# Altium project audio_dev_pcb.PrjPcb (part 2 of 3)

## Sheet USB_HS.SchDoc
size A3; SheetNumber: 5; SheetTotal: 13
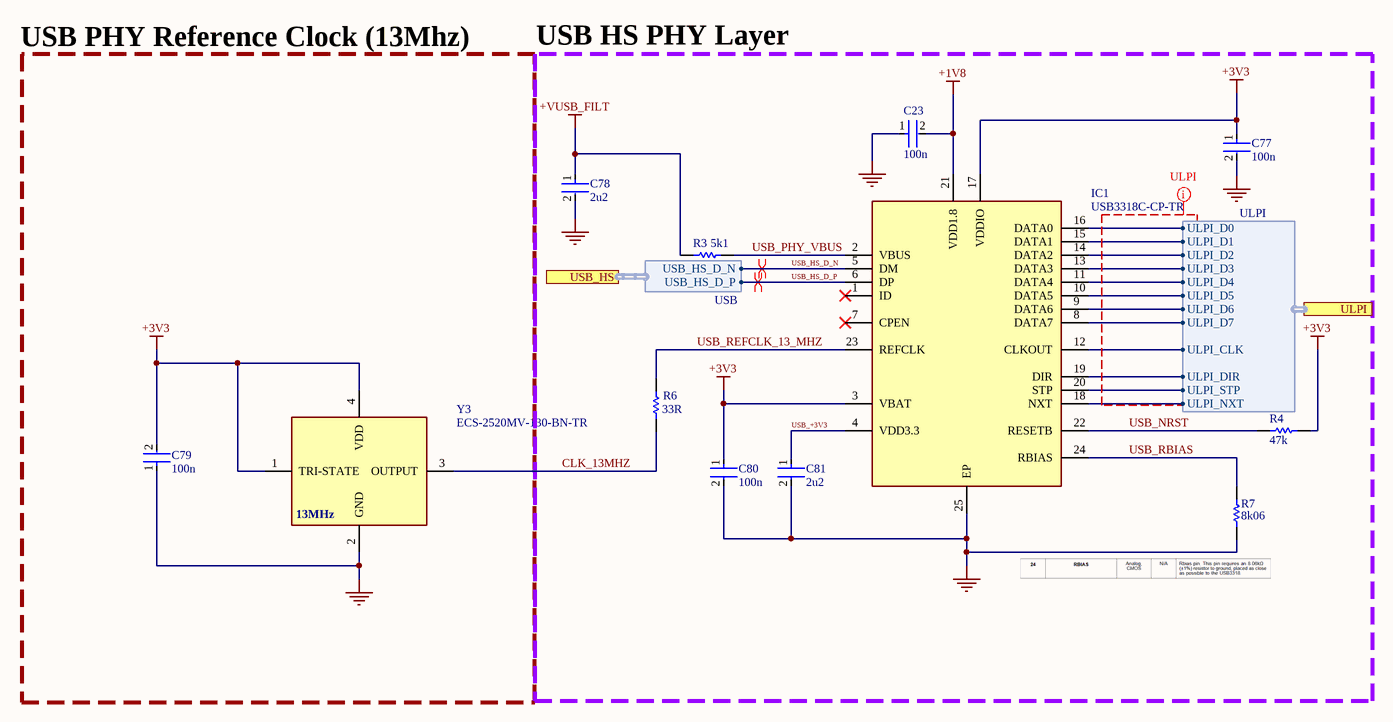
[diagram p6: USB_HS.SchDoc]

### Parts
C23  Capacitance: 100n  [FP-GCM155-0_05-IPC_A]  (hidden comment: GCM155R71H104ME02J)
C77  Capacitance: 100n  [FP-GCM155-0_05-IPC_A]  (hidden comment: GCM155R71H104ME02J)
C78  Capacitance: 2u2  [FP-GCH188-0_1-e0_2_0_5-MFG]  (hidden comment: GCM188C71A225KE02D)
C79  Capacitance: 100n  [FP-GCM155-0_05-IPC_A]  (hidden comment: GCM155R71H104ME02J)
C80  Capacitance: 100n  [FP-GCM155-0_05-IPC_A]  (hidden comment: GCM155R71H104ME02J)
C81  Capacitance: 2u2  [FP-GCH188-0_1-e0_2_0_5-MFG]  (hidden comment: GCM188C71A225KE02D)
IC1  USB3318C-CP-TR  [QFN50P400X400X100-25N-D]
R3  Resistance: 5k1  [RESC1005X40X25ML05T10]  (hidden comment: RC0402JR-075K1L)
R4  Resistance: 47k  [RESC1005X40X25LL05T10]  (hidden comment: RC0402JR-0747KL)
R6  Resistance: 33R  [RESC1005X40X25ML05T10]  (hidden comment: RC0402JR-1333RL)
R7  Resistance: 8k06  [RESC1005X40X25NL05T10]  (hidden comment: RC0402FR-07806KL)
Y3  ECS-2520MV-130-BN-TR  [ECS2520MV130BNTR]

### Blocks framed on the sheet
USB PHY Reference Clock (13Mhz): C79 Y3
USB HS PHY Layer: C23 C77 C78 C80 C81 IC1 R3 R4 R6 R7

### Ports
ULPI (harness ULPI, see high_level[5B], MCU_Connections[1B]), USB_HS (harness USB, see high_level[5B], Peripherals[4A])

### Harnesses
USB: USB_HS_D_N, USB_HS_D_P
ULPI: ULPI_D0, ULPI_D1, ULPI_D2, ULPI_D3, ULPI_D4, ULPI_D5, ULPI_D6, ULPI_D7, ULPI_CLK, ULPI_DIR, ULPI_STP, ULPI_NXT

### Nets
+1V8: C23.2 IC1.21(VDD1.8)
+3V3: C77.1 C79.2 C80.1 IC1.3(VBAT) IC1.17(VDDIO) R4.2 Y3.1(TRI-STATE) Y3.4(VDD)
+VUSB_FILT: C78.1 R3.1
GND: C23.1 C77.2 C78.2 C79.1 C80.2 C81.2 IC1.25(EP) R7.1 Y3.2(GND)
CLK_13MHZ: R6.2 Y3.3(OUTPUT)
USB_+3V3: C81.1 IC1.4(VDD3.3)
USB_HS_D_N: IC1.5(DM) ; port USB_HS.USB_HS_D_N
USB_HS_D_P: IC1.6(DP) ; port USB_HS.USB_HS_D_P
USB_NRST: IC1.22(RESETB) R4.1
USB_PHY_VBUS: IC1.2(VBUS) R3.2
USB_RBIAS: IC1.24(RBIAS) R7.2
USB_REFCLK_13_MHZ: IC1.23(REFCLK) R6.1
NetIC1_8: IC1.8(DATA7) ; port ULPI.ULPI_D7
NetIC1_9: IC1.9(DATA6) ; port ULPI.ULPI_D6
NetIC1_10: IC1.10(DATA5) ; port ULPI.ULPI_D5
NetIC1_11: IC1.11(DATA4) ; port ULPI.ULPI_D4
NetIC1_12: IC1.12(CLKOUT) ; port ULPI.ULPI_CLK
NetIC1_13: IC1.13(DATA3) ; port ULPI.ULPI_D3
NetIC1_14: IC1.14(DATA2) ; port ULPI.ULPI_D2
NetIC1_15: IC1.15(DATA1) ; port ULPI.ULPI_D1
NetIC1_16: IC1.16(DATA0) ; port ULPI.ULPI_D0
NetIC1_18: IC1.18(NXT) ; port ULPI.ULPI_NXT
NetIC1_19: IC1.19(DIR) ; port ULPI.ULPI_DIR
NetIC1_20: IC1.20(STP) ; port ULPI.ULPI_STP

Not connected (* = marked no-connect by the designer): IC1 1(ID)* 7(CPEN)*

### Layout directives
mark named ULPI: (no net found under the mark)
differential pair: USB_HS_D_N, USB_HS_D_P

### Notes on the sheet
- (near Y3) 13MHz

### Library data of the parts
C23 C77 C79 C80 = CMP-06035-028957-1: as C95 on sheet Memory
C78 C81 = CMP-00260-57357036-1: as C94 on sheet Memory; NexarPartId: 57357036; RoHS: Non-Compliant; Lifecycle Status: Production
IC1 = USB3318C-CP-TR: Integrated Circuit; Manufacturer_Name: Microchip; Datasheet Link: http://www.microchip.com/mymicrochip/filehandler.aspx?ddocname=en562029; Height: 1mm; Manufacturer_Part_Number: USB3318C-CP-TR; Mouser Part Number: 886-USB3318C-CP-TR; Mouser Price/Stock: https://www.mouser.co.uk/ProductDetail/Microchip-Technology/USB3318C-CP-TR?qs=pA5MXup5wxEqKRd0j%252Bo%252BXA%3D%3D; Arrow Part Number: USB3318C-CP-TR; Arrow Price/Stock: null?region=nac
R3 = CMP-2002-08025-1: Manufacturer: Yageo / Phycomp; Part Number: RC0402JR-075K1L
R4 = CMP-1011-00114-2: Manufacturer: Yageo / Phycomp; Part Number: RC0402JR-0747KL
R6 = CMP-2002-08082-1: Manufacturer: Yageo; Part Number: RC0402JR-1333RL
R7 = CMP-1011-00838-2: Manufacturer: Yageo / Phycomp; Part Number: RC0402FR-07806KL
Y3 = ECS-2520MV-130-BN-TR: Crystal or Oscillator; Manufacturer_Name: ECS; Datasheet Link: https://ecsxtal.com/store/pdf/ECS-2520MV.pdf; Height: 0.9mm; Manufacturer_Part_Number: ECS-2520MV-130-BN-TR; Mouser Part Number: 520-S2520MV130BNTR; Mouser Price/Stock: https://www.mouser.co.uk/ProductDetail/ECS/ECS-2520MV-130-BN-TR?qs=zW32dvEIR3txl7djIFQDkw%3D%3D; Arrow Part Number: ECS-2520MV-130-BN-TR; Arrow Price/Stock: https://www.arrow.com/en/products/ecs-2520mv-130-bn-tr/ecs-international?utm_currency=USD&region=nac

## Sheet Peripherals.SchDoc
size A3; SheetNumber: 7; SheetTotal: 13
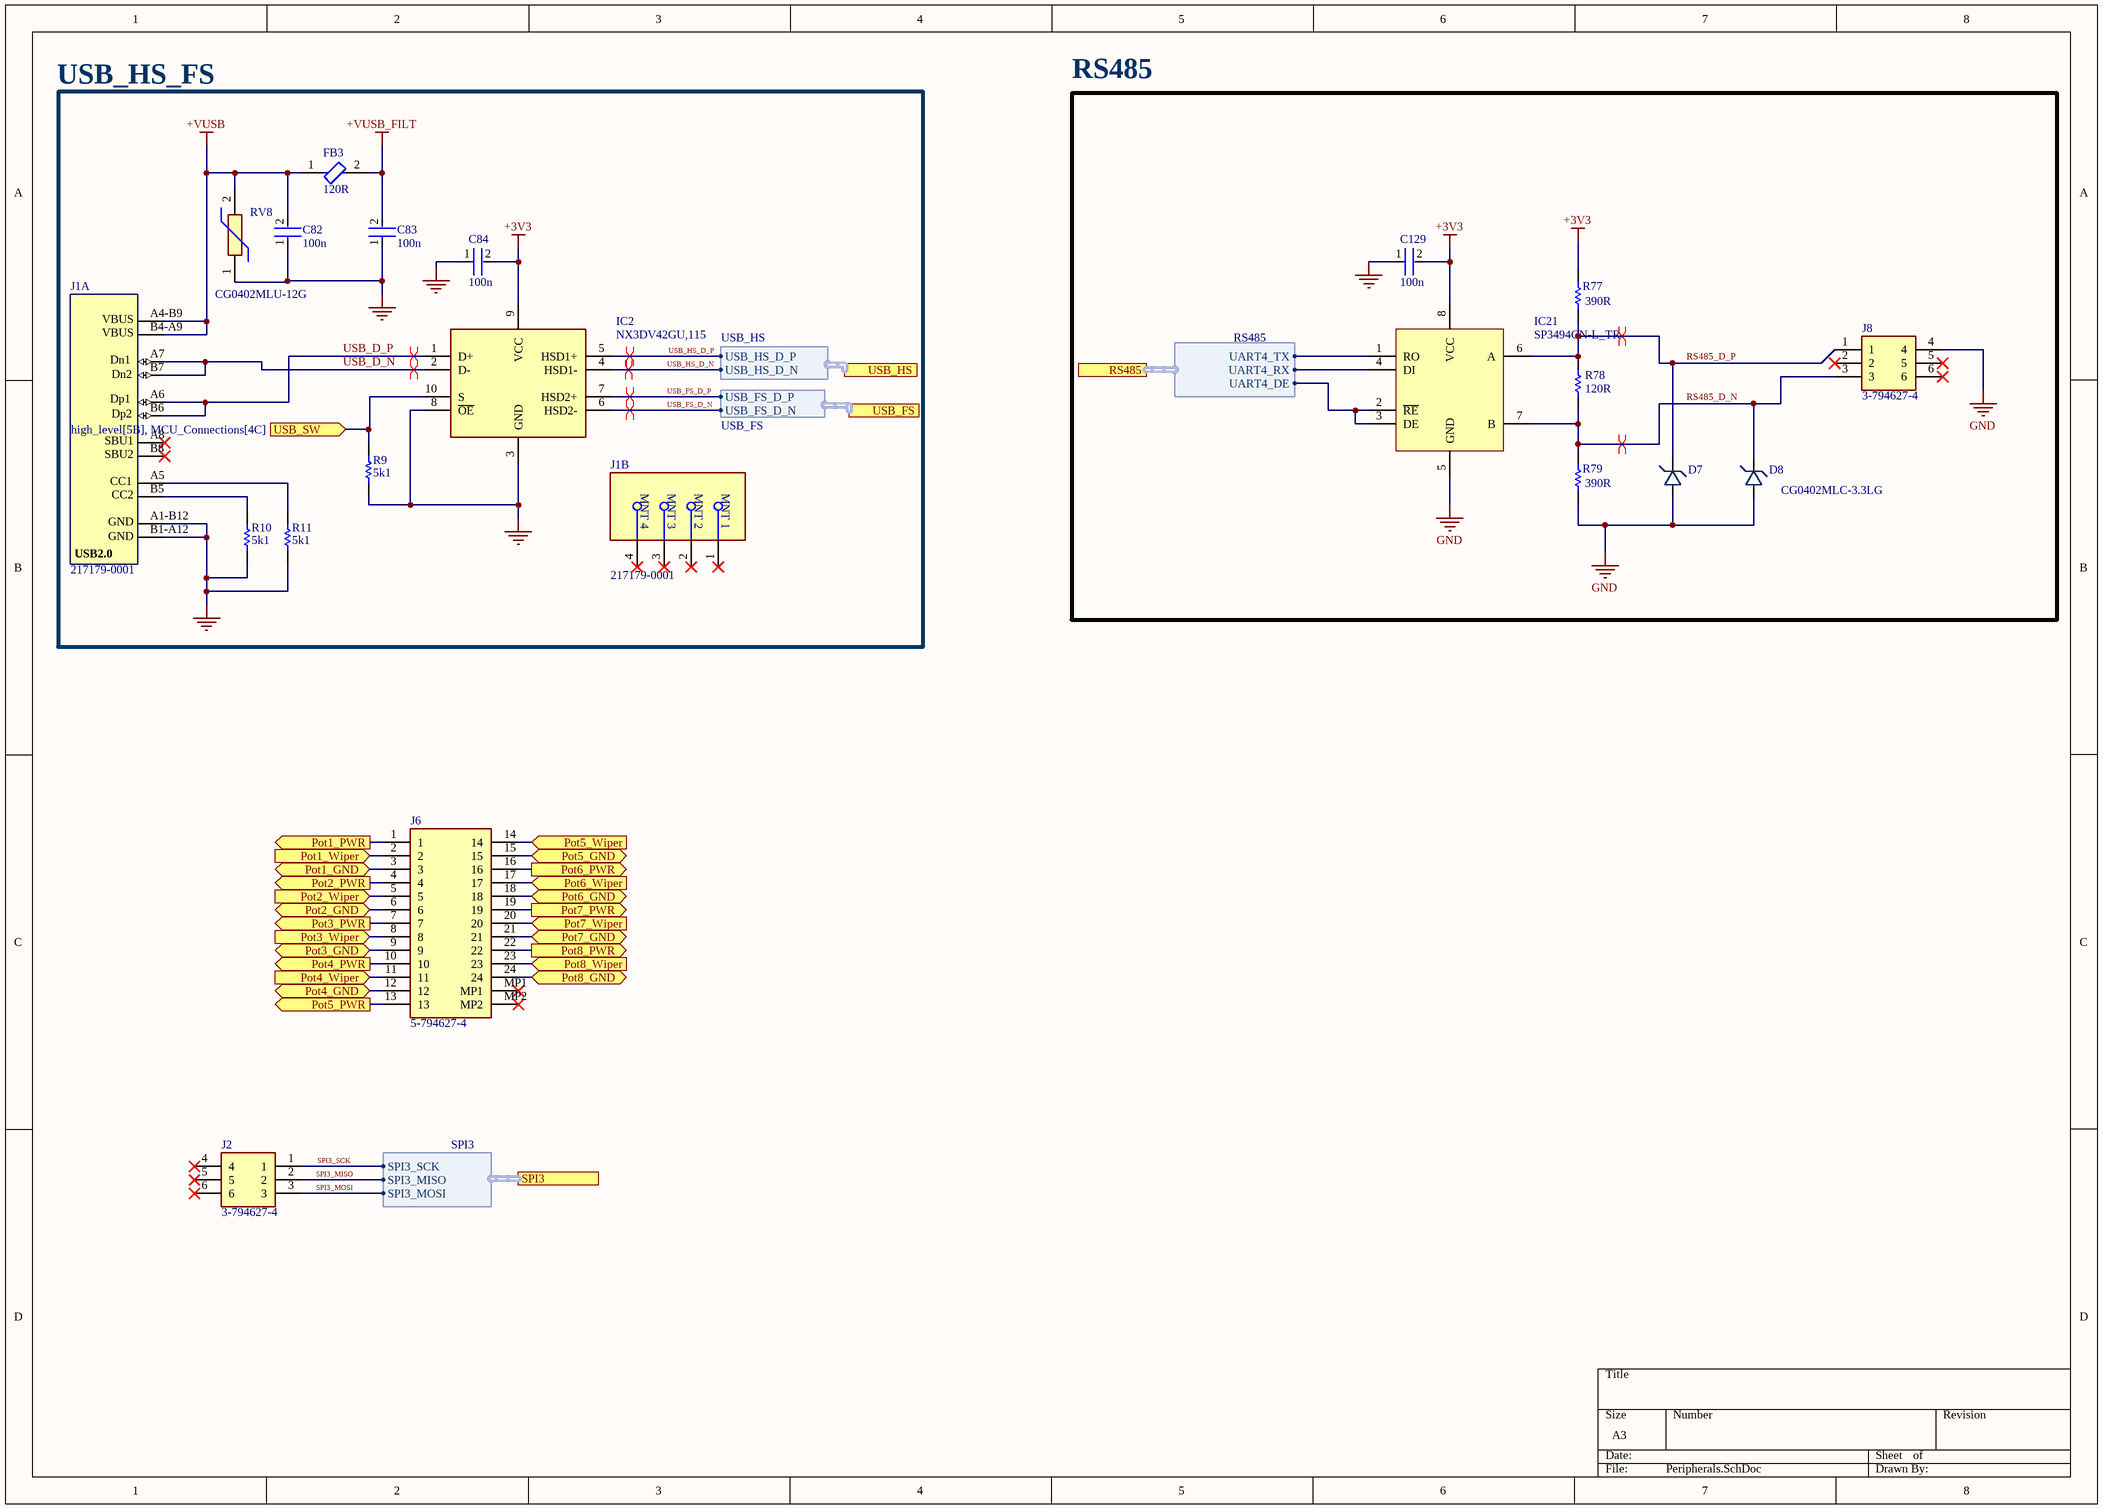
[diagram p7: Peripherals.SchDoc]

### Parts
C82  Capacitance: 100n  [FP-GCM155-0_05-IPC_A]  (hidden comment: GCM155R71H104ME02J)
C83  Capacitance: 100n  [FP-GCM155-0_05-IPC_A]  (hidden comment: GCM155R71H104ME02J)
C84  Capacitance: 100n  [FP-GCM155-0_05-IPC_A]  (hidden comment: GCM155R71H104ME02J)
C129  Capacitance: 100n  [FP-GCM155-0_05-IPC_A]  (hidden comment: GCM155R71H104ME02J)
D7  CG0402MLC-3.3LG  [CG0402MLC-3.3LG]  (value not drawn)
D8  CG0402MLC-3.3LG  [CG0402MLC-3.3LG]
FB3  Impedance: 120R  [FP-MPZ1005-MFG]  (hidden comment: MPZ1005S121ET000)
IC2  NX3DV42GU,115  [QFN40P140X180X50-10N]
IC21  SP3494CN-L_TR  [SOIC127P600X175-8N]
J1  217179-0001  [FP-2171790001-MFG]  (parts A,B of 2)
J2  3-794627-4  [37946274]
J6  5-794627-4  [57946274]
J8  3-794627-4  [37946274]
R9  Resistance: 5k1  [RESC1005X40X25ML05T10]  (hidden comment: RC0402JR-075K1L)
R10  Resistance: 5k1  [RESC1005X40X25ML05T10]  (hidden comment: RC0402JR-075K1L)
R11  Resistance: 5k1  [RESC1005X40X25ML05T10]  (hidden comment: RC0402JR-075K1L)
R77  Resistance: 390R  [RESC1005X40X25ML05T10]  (hidden comment: RC0402JR-07390RL)
R78  Resistance: 120R  [RESC1005X40X25NL05T10]  (hidden comment: RC0402FR-07120RL)
R79  Resistance: 390R  [RESC1005X40X25ML05T10]  (hidden comment: RC0402JR-07390RL)
RV8  CG0402MLU-12G  [VARC1005X41N]

### Blocks framed on the sheet
USB_HS_FS: C82-C84 FB3 IC2 J1 R9-R11 RV8
RS485: C129 D7 D8 IC21 J8 R77-R79

### Ports
Pot1_GND (bidir, see high_level[5C], Potentiometers[1B]), Pot1_PWR (out, see high_level[5C], Potentiometers[1A]), Pot1_Wiper (in, see high_level[5C], Potentiometers[1A]), Pot2_GND (bidir, see high_level[5C], Potentiometers[1B]), Pot2_PWR (out, see high_level[5C], Potentiometers[1B]), Pot2_Wiper (in, see high_level[5C], Potentiometers[1B]), Pot3_GND (bidir, see high_level[5C], Potentiometers[1C]), Pot3_PWR (out, see high_level[5C], Potentiometers[1C]), Pot3_Wiper (in, see high_level[5C], Potentiometers[1C]), Pot4_GND (bidir, see high_level[5C], Potentiometers[5B]), Pot4_PWR (out, see high_level[5C], Potentiometers[5A]), Pot4_Wiper (in, see high_level[5C], Potentiometers[5A]), Pot5_GND (bidir, see high_level[5C], Potentiometers[5B]), Pot5_PWR (out, see high_level[5C], Potentiometers[5B]), Pot5_Wiper (in, see high_level[5C], Potentiometers[5B]), Pot6_GND (bidir, see high_level[5C], Potentiometers[5C]), Pot6_PWR (out, see high_level[5C], Potentiometers[5C]), Pot6_Wiper (in, see high_level[5C], Potentiometers[5C]), Pot7_GND (bidir, see high_level[5C], Potentiometers[1D]), Pot7_PWR (out, see high_level[5C], Potentiometers[1D]), Pot7_Wiper (in, see high_level[5C], Potentiometers[1D]), Pot8_GND (bidir, see high_level[5C], Potentiometers[5D]), Pot8_PWR (out, see high_level[5C], Potentiometers[5D]), Pot8_Wiper (in, see high_level[5C], Potentiometers[5D]), RS485 (harness RS485, see high_level[5B], MCU_Connections[4C]), SPI3 (harness SPI3, see high_level[5B], MCU_Connections[5C]), USB_FS (harness USB_FS, see high_level[5B], MCU_Connections[4C]), USB_HS (harness USB_HS, see high_level[5B], USB_HS[4B]), USB_SW (in, see high_level[5B], MCU_Connections[4C])

### Harnesses
USB_HS: USB_HS_D_P, USB_HS_D_N
USB_FS: USB_FS_D_P, USB_FS_D_N
SPI3: SPI3_SCK, SPI3_MISO, SPI3_MOSI
RS485: UART4_TX, UART4_RX, UART4_DE

### Nets
+3V3: C84.2 C129.2 IC2.9(VCC) IC21.8(VCC) J6.1 J6.4 J6.7 J6.10 J6.13 J6.16 J6.19 J6.22 R77.2 ; port Pot5_PWR, port Pot4_PWR, port Pot8_PWR, port Pot6_PWR, port Pot2_PWR, port Pot7_PWR, port Pot3_PWR, port Pot1_PWR
+VUSB: C82.2 FB3.1 J1.A4-B9(VBUS) J1.B4-A9(VBUS) RV8.2
+VUSB_FILT: C83.2 FB3.2
GND: C82.1 C83.1 C84.1 C129.1 D7.2 D8.2 IC2.3(GND) IC2.8(~{OE}) IC21.5(GND) J1.A1-B12(GND) J1.B1-A12(GND) J6.3 J6.6 J6.9 J6.12 J6.15 J6.18 J6.21 J6.24 J8.4 R9.1 R10.1 R11.1 R79.1 RV8.1 ; port Pot5_GND, port Pot4_GND, port Pot8_GND, port Pot6_GND, port Pot2_GND, port Pot1_GND, port Pot7_GND, port Pot3_GND
Pot1_Wiper: J6.2 ; port Pot1_Wiper
Pot2_Wiper: J6.5 ; port Pot2_Wiper
Pot3_Wiper: J6.8 ; port Pot3_Wiper
Pot4_Wiper: J6.11 ; port Pot4_Wiper
Pot5_Wiper: J6.14 ; port Pot5_Wiper
Pot6_Wiper: J6.17 ; port Pot6_Wiper
Pot7_Wiper: J6.20 ; port Pot7_Wiper
Pot8_Wiper: J6.23 ; port Pot8_Wiper
RS485_D_N: D8.1 IC21.7(B) J8.3 R78.1 R79.2
RS485_D_P: D7.1 IC21.6(A) J8.1 R77.1 R78.2
SPI3_MISO: J2.2 ; port SPI3.SPI3_MISO
SPI3_MOSI: J2.3 ; port SPI3.SPI3_MOSI
SPI3_SCK: J2.1 ; port SPI3.SPI3_SCK
USB_D_N: IC2.2(D-) J1.A7(Dn1) J1.B7(Dn2)
USB_D_P: IC2.1(D+) J1.A6(Dp1) J1.B6(Dp2)
USB_FS_D_N: IC2.6(HSD2-) ; port USB_FS.USB_FS_D_N
USB_FS_D_P: IC2.7(HSD2+) ; port USB_FS.USB_FS_D_P
USB_HS_D_N: IC2.4(HSD1-) ; port USB_HS.USB_HS_D_N
USB_HS_D_P: IC2.5(HSD1+) ; port USB_HS.USB_HS_D_P
USB_SW: IC2.10(S) R9.2 ; port USB_SW
NetIC21_1: IC21.1(RO) ; port RS485.UART4_TX
NetIC21_2: IC21.2(~{RE}) IC21.3(DE) ; port RS485.UART4_DE
NetIC21_4: IC21.4(DI) ; port RS485.UART4_RX
NetJ1_A5: J1.A5(CC1) R11.2
NetJ1_B5: J1.B5(CC2) R10.2

Not connected (* = marked no-connect by the designer): J1 1(MNT_1)* 2(MNT_2)* 3(MNT_3)* 4(MNT_4)* A8(SBU1)* B8(SBU2)*; J2 4* 5* 6*; J6 MP1* MP2*; J8 2* 5* 6*

### Layout directives
differential pair: (no net found under the mark), RS485_D_N, RS485_D_P, USB_D_N, USB_D_P, USB_FS_D_N, USB_FS_D_P, USB_HS_D_P

### Notes on the sheet
- (in symbol CMP-04767-000028-2, part A) USB2.0

### Library data of the parts
C82-C84 C129 = CMP-06035-028957-1: as C95 on sheet Memory
FB3 = CMP-08257-000274-1: Power line Ferrite Bead 120Ω @ 100MHz 1.5A DCR 0.095Ω SMD 0402; Tolerance: 25%; Number of Lines: 1; DC Resistance (DCR): 95mR; RoHS Compliant: Yes; Test Frequency: 100MHz; Length: 0.039inch; Case Code (Metric): 1005; Case/Package: 0402; Max Operating Temperature: 125°C; Max Current Rating: 1.5A; Termination: SMD/SMT; Case Code (Imperial): 0402; Width: 0.02inch; Weight: 2.3E-05oz; Max DC Current: 1.5A; Height: 0.022inch; Package Quantity: 10000; Mount: Surface Mount; Min Operating Temperature: -55°C; Packaging: Tape and Reel
IC2 = NX3DV42GU,115: Integrated Circuit; Manufacturer_Name: NXP; Datasheet Link: http://www.nxp.com/docs/en/data-sheet/NX3DV42.pdf; Height: 0.5mm; Manufacturer_Part_Number: NX3DV42GU,115; Mouser Part Number: 771-NX3DV42GU115; Mouser Price/Stock: https://www.mouser.co.uk/ProductDetail/NXP-Semiconductors/NX3DV42GU115?qs=cbprxTG2Yq%252BinzuyAklGVQ%3D%3D; Arrow Part Number: NX3DV42GU,115; Arrow Price/Stock: https://www.arrow.com/en/products/nx3dv42gu115/nxp-semiconductors?region=nac
IC21 = SP3494CN-L_TR: Integrated Circuit; Manufacturer_Name: MaxLinear; Manufacturer_Part_Number: SP3494CN-L/TR; Datasheet Link: https://www.arrow.com/en/products/sp3494cn-ltr/maxlinear-inc?region=nac; Height: 1.75mm; Mouser Part Number: 701-SP3494CN-L/TR; Mouser Price/Stock: https://www.mouser.co.uk/ProductDetail/MaxLinear/SP3494CN-L-TR?qs=3EMgrMjM0faUFCPV%252BPTaUQ%3D%3D; Arrow Part Number: SP3494CN-L/TR; Arrow Price/Stock: https://www.arrow.com/en/products/sp3494cn-ltr/maxlinear-inc?region=nac
J1 = CMP-04767-000028-2: CONN RCP USB2.0 TYP C 24P SMD RA; NexarPartId: 117190526; Gender: Receptacle; Number of Contacts: 16; Current Rating: 1.25A; Voltage Rating: 30V; Min Operating Temperature: -40°C; USB Standard: USB 2.0; Height: 3.36mm; Contact Material: Gold, Nickel; Max Operating Temperature: 85°C
J2 J8 = 3-794627-4: Connector; Manufacturer_Name: TE Connectivity; Datasheet Link: https://www.te.com/commerce/DocumentDelivery/DDEController?Action=srchrtrv&DocNm=micro-mate-n-lok-connector-qrg&DocType=Data%20Sheet&DocLang=English&PartCntxt=3-794627-4&DocFormat=pdf; Height: 8.8mm; Manufacturer_Part_Number: 3-794627-4; Mouser Part Number: 571-3-794627-4; Mouser Price/Stock: https://www.mouser.co.uk/ProductDetail/TE-Connectivity-AMP/3-794627-4?qs=FGSkXkE%2FZ3Wegb353BDzUA%3D%3D; Arrow Part Number: 3-794627-4; Arrow Price/Stock: https://www.arrow.com/en/products/3-794627-4/te-connectivity?utm_currency=USD&region=europe
J6 = 5-794627-4: Connector; Manufacturer_Name: TE Connectivity; Datasheet Link: https://www.te.com/commerce/DocumentDelivery/DDEController?Action=srchrtrv&DocNm=micro-mate-n-lok-connector-qrg&DocType=Data%20Sheet&DocLang=English&PartCntxt=5-794627-4&DocFormat=pdf; Height: 8.8mm; Manufacturer_Part_Number: 5-794627-4
R9-R11 = CMP-2002-08025-1: Manufacturer: Yageo / Phycomp; Part Number: RC0402JR-075K1L
R77 R79 = CMP-2002-07992-1: Manufacturer: Yageo / Phycomp; Part Number: RC0402JR-07390RL
R78 = CMP-2002-07370-1: Manufacturer: Yageo / Phycomp; Part Number: RC0402FR-07120RL
RV8 = CG0402MLU-12G: Varistor; Manufacturer_Name: Bourns; Datasheet Link: https://bourns.com/docs/product-datasheets/mlu.pdf?sfvrsn=1940d498_27; Height: 0.41mm; Manufacturer_Part_Number: CG0402MLU-12G; Mouser Part Number: 652-CG0402MLU-12G; Mouser Price/Stock: https://www.mouser.co.uk/ProductDetail/Bourns/CG0402MLU-12G?qs=m8myXnDJXpUNz33UIHxVhA%3D%3D; Arrow Part Number: CG0402MLU-12G; Arrow Price/Stock: https://www.arrow.com/en/products/cg0402mlu-12g/bourns?utm_currency=USD&region=nac

## Sheet Potentiometers.SchDoc
size A2; SheetNumber: 10; SheetTotal: 13
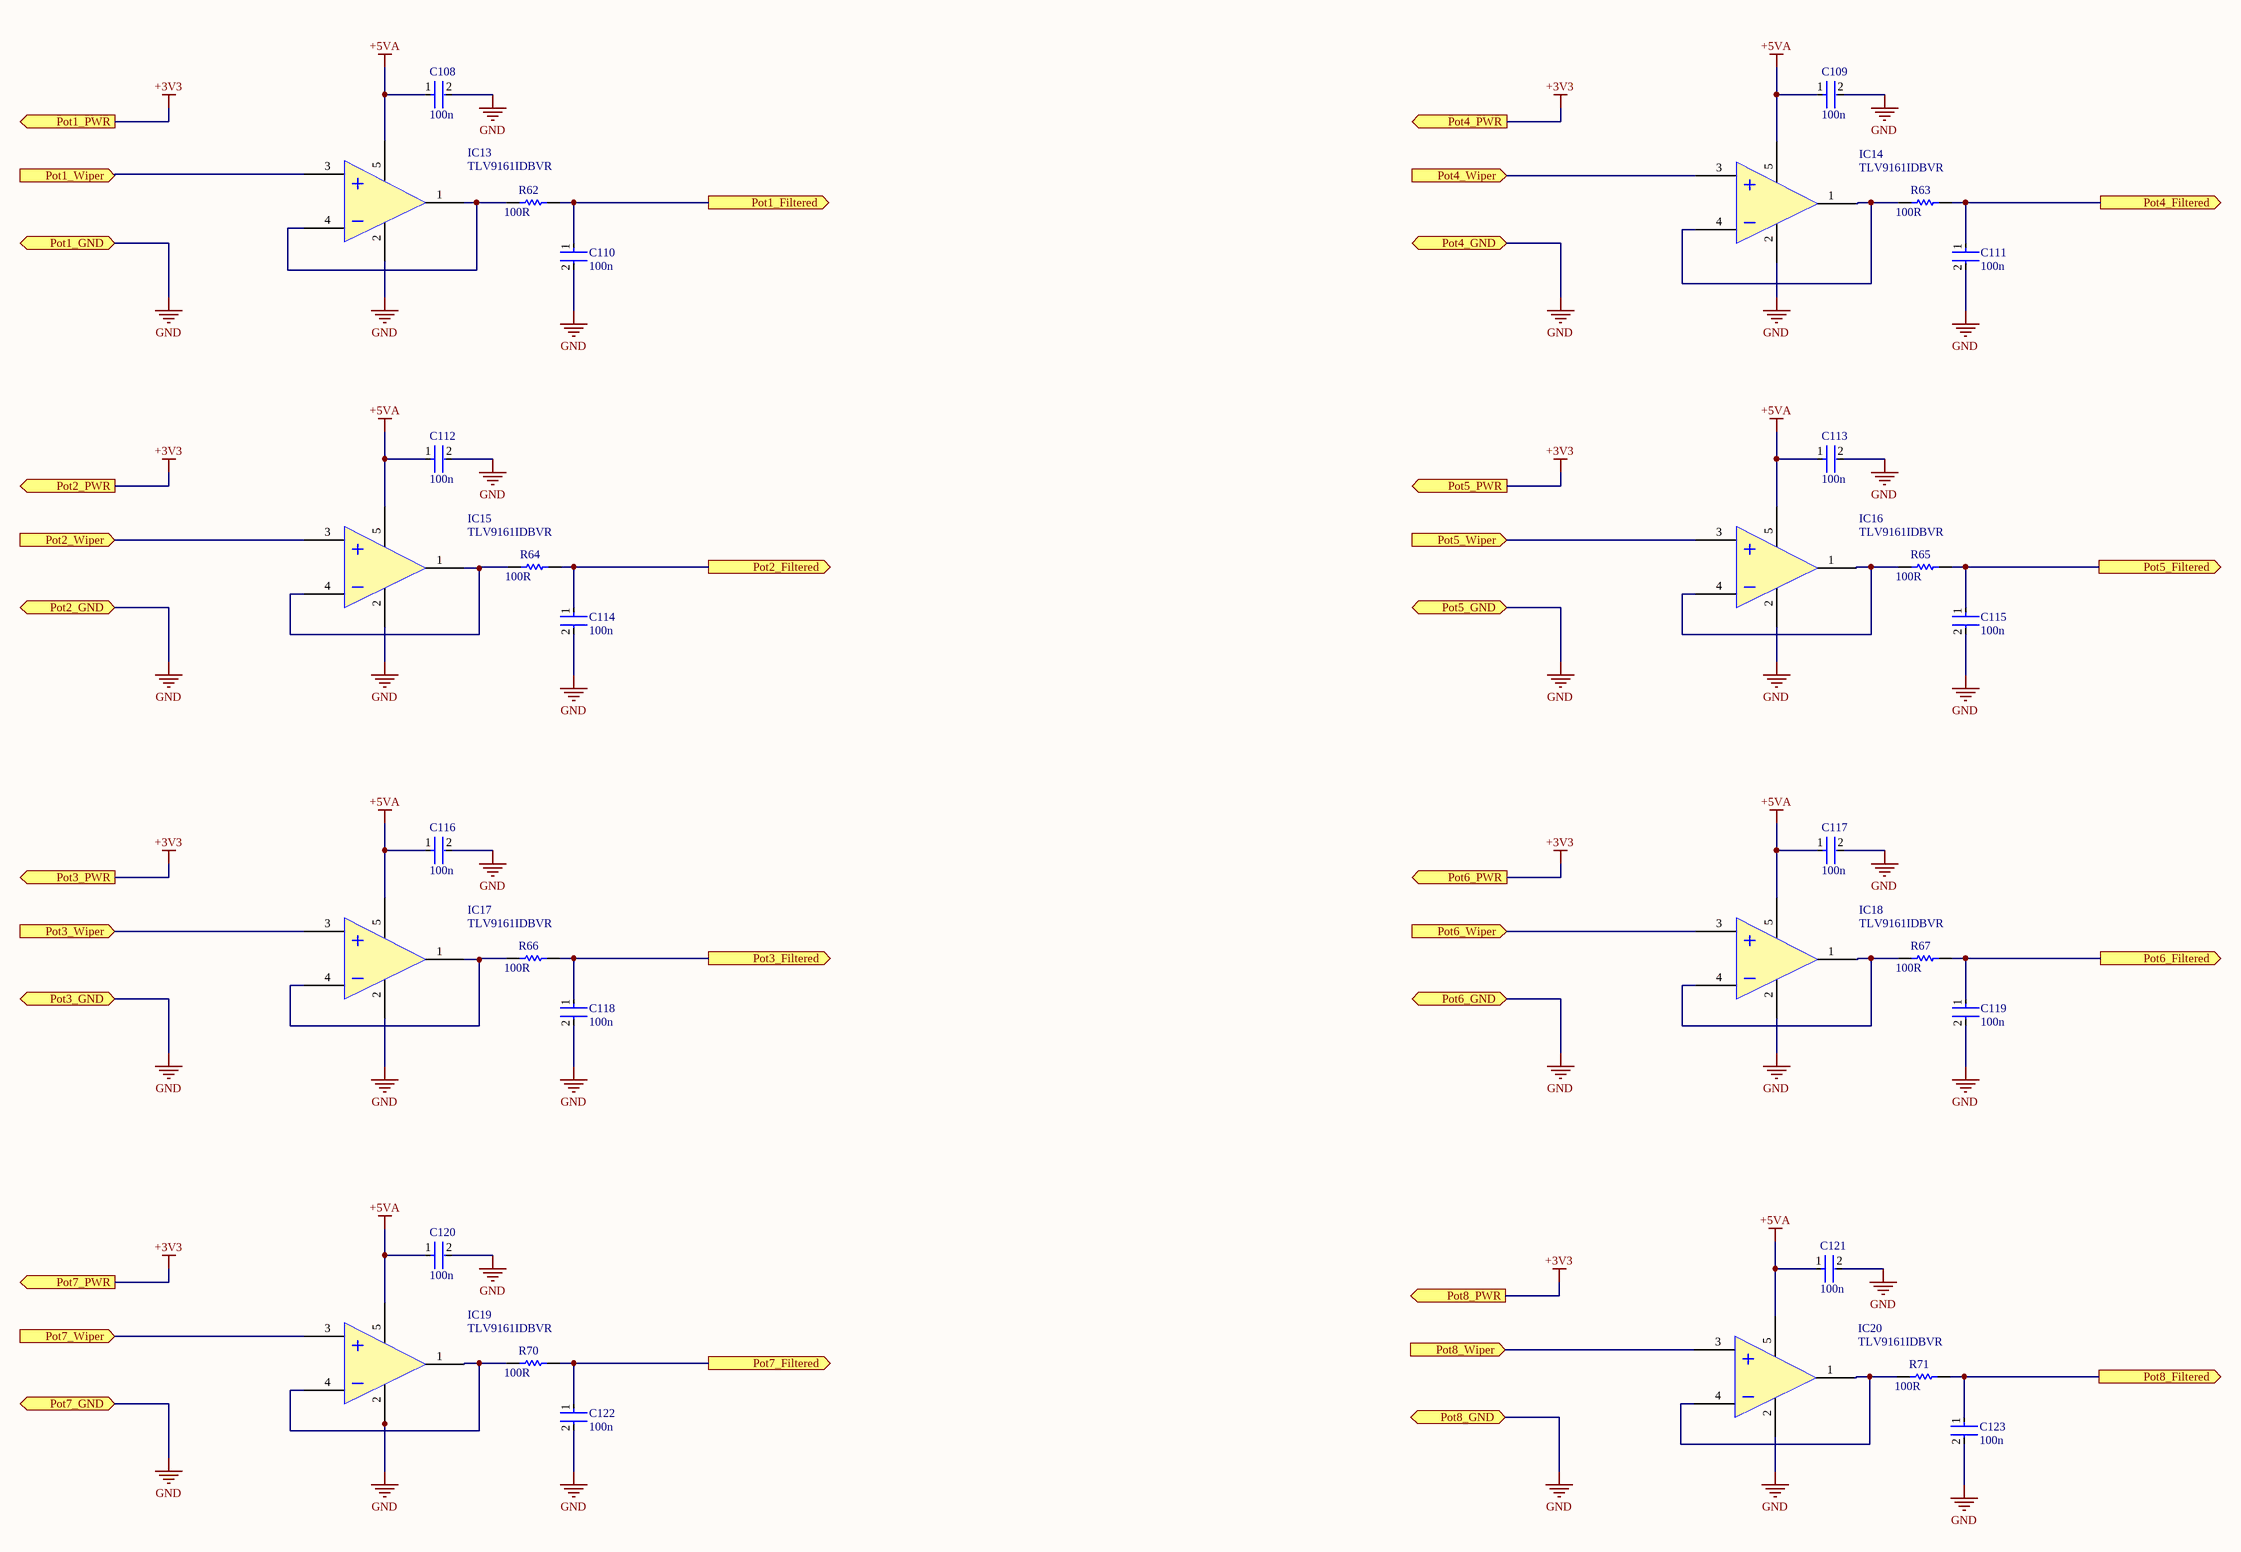
[diagram p8: Potentiometers.SchDoc]

### Parts
C108  Capacitance: 100n  [FP-GCM155-0_05-IPC_A]  (hidden comment: GCM155R71H104ME02J)
C109  Capacitance: 100n  [FP-GCM155-0_05-IPC_A]  (hidden comment: GCM155R71H104ME02J)
C110  Capacitance: 100n  [FP-GCM155-0_05-IPC_A]  (hidden comment: GCM155R71H104ME02J)
C111  Capacitance: 100n  [FP-GCM155-0_05-IPC_A]  (hidden comment: GCM155R71H104ME02J)
C112  Capacitance: 100n  [FP-GCM155-0_05-IPC_A]  (hidden comment: GCM155R71H104ME02J)
C113  Capacitance: 100n  [FP-GCM155-0_05-IPC_A]  (hidden comment: GCM155R71H104ME02J)
C114  Capacitance: 100n  [FP-GCM155-0_05-IPC_A]  (hidden comment: GCM155R71H104ME02J)
C115  Capacitance: 100n  [FP-GCM155-0_05-IPC_A]  (hidden comment: GCM155R71H104ME02J)
C116  Capacitance: 100n  [FP-GCM155-0_05-IPC_A]  (hidden comment: GCM155R71H104ME02J)
C117  Capacitance: 100n  [FP-GCM155-0_05-IPC_A]  (hidden comment: GCM155R71H104ME02J)
C118  Capacitance: 100n  [FP-GCM155-0_05-IPC_A]  (hidden comment: GCM155R71H104ME02J)
C119  Capacitance: 100n  [FP-GCM155-0_05-IPC_A]  (hidden comment: GCM155R71H104ME02J)
C120  Capacitance: 100n  [FP-GCM155-0_05-IPC_A]  (hidden comment: GCM155R71H104ME02J)
C121  Capacitance: 100n  [FP-GCM155-0_05-IPC_A]  (hidden comment: GCM155R71H104ME02J)
C122  Capacitance: 100n  [FP-GCM155-0_05-IPC_A]  (hidden comment: GCM155R71H104ME02J)
C123  Capacitance: 100n  [FP-GCM155-0_05-IPC_A]  (hidden comment: GCM155R71H104ME02J)
IC13  TLV9161IDBVR  [SOT95P280X145-5N]
IC14  TLV9161IDBVR  [SOT95P280X145-5N]
IC15  TLV9161IDBVR  [SOT95P280X145-5N]
IC16  TLV9161IDBVR  [SOT95P280X145-5N]
IC17  TLV9161IDBVR  [SOT95P280X145-5N]
IC18  TLV9161IDBVR  [SOT95P280X145-5N]
IC19  TLV9161IDBVR  [SOT95P280X145-5N]
IC20  TLV9161IDBVR  [SOT95P280X145-5N]
R62  Resistance: 100R  [RESC1005X40X25NL05T10]  (hidden comment: RC0402JR-07100RL)
R63  Resistance: 100R  [RESC1005X40X25NL05T10]  (hidden comment: RC0402JR-07100RL)
R64  Resistance: 100R  [RESC1005X40X25NL05T10]  (hidden comment: RC0402JR-07100RL)
R65  Resistance: 100R  [RESC1005X40X25NL05T10]  (hidden comment: RC0402JR-07100RL)
R66  Resistance: 100R  [RESC1005X40X25NL05T10]  (hidden comment: RC0402JR-07100RL)
R67  Resistance: 100R  [RESC1005X40X25NL05T10]  (hidden comment: RC0402JR-07100RL)
R70  Resistance: 100R  [RESC1005X40X25NL05T10]  (hidden comment: RC0402JR-07100RL)
R71  Resistance: 100R  [RESC1005X40X25NL05T10]  (hidden comment: RC0402JR-07100RL)

### Ports
Pot1_Filtered (out, see high_level[4C], MCU_Connections[6C]), Pot1_GND (bidir, see high_level[5C], Peripherals[2C]), Pot1_PWR (out, see high_level[5C], Peripherals[2C]), Pot1_Wiper (in, see high_level[5C], Peripherals[2C]), Pot2_Filtered (out, see high_level[4C], MCU_Connections[6C]), Pot2_GND (bidir, see high_level[5C], Peripherals[2C]), Pot2_PWR (out, see high_level[5C], Peripherals[2C]), Pot2_Wiper (in, see high_level[5C], Peripherals[2C]), Pot3_Filtered (out, see high_level[4C], MCU_Connections[6C]), Pot3_GND (bidir, see high_level[5C], Peripherals[2C]), Pot3_PWR (out, see high_level[5C], Peripherals[2C]), Pot3_Wiper (in, see high_level[5C], Peripherals[2C]), Pot4_Filtered (out, see high_level[4C], MCU_Connections[6C]), Pot4_GND (bidir, see high_level[5C], Peripherals[2C]), Pot4_PWR (out, see high_level[5C], Peripherals[2C]), Pot4_Wiper (in, see high_level[5C], Peripherals[2C]), Pot5_Filtered (out, see high_level[4C], MCU_Connections[6C]), Pot5_GND (bidir, see high_level[5C], Peripherals[3C]), Pot5_PWR (out, see high_level[5C], Peripherals[2C]), Pot5_Wiper (in, see high_level[5C], Peripherals[3C]), Pot6_Filtered (out, see high_level[4C], MCU_Connections[6C]), Pot6_GND (bidir, see high_level[5C], Peripherals[3C]), Pot6_PWR (out, see high_level[5C], Peripherals[3C]), Pot6_Wiper (in, see high_level[5C], Peripherals[3C]), Pot7_Filtered (out, see high_level[4C], MCU_Connections[6C]), Pot7_GND (bidir, see high_level[5C], Peripherals[3C]), Pot7_PWR (out, see high_level[5C], Peripherals[3C]), Pot7_Wiper (in, see high_level[5C], Peripherals[3C]), Pot8_Filtered (out, see high_level[4C], MCU_Connections[6C]), Pot8_GND (bidir, see high_level[5C], Peripherals[3C]), Pot8_PWR (out, see high_level[5C], Peripherals[3C]), Pot8_Wiper (in, see high_level[5C], Peripherals[3C])

### Nets
+3V3: port Pot1_PWR, port Pot2_PWR, port Pot3_PWR, port Pot4_PWR, port Pot5_PWR, port Pot6_PWR, port Pot7_PWR, port Pot8_PWR
+5VA: C108.1 C109.1 C112.1 C113.1 C116.1 C117.1 C120.1 C121.1 IC13.5(V+) IC14.5(V+) IC15.5(V+) IC16.5(V+) IC17.5(V+) IC18.5(V+) IC19.5(V+) IC20.5(V+)
GND: C108.2 C109.2 C110.2 C111.2 C112.2 C113.2 C114.2 C115.2 C116.2 C117.2 C118.2 C119.2 C120.2 C121.2 C122.2 C123.2 IC13.2(V-) IC14.2(V-) IC15.2(V-) IC16.2(V-) IC17.2(V-) IC18.2(V-) IC19.2(V-) IC20.2(V-) ; port Pot1_GND, port Pot2_GND, port Pot3_GND, port Pot4_GND, port Pot5_GND, port Pot6_GND, port Pot7_GND, port Pot8_GND
Pot1_Filtered: C110.1 R62.2 ; port Pot1_Filtered
Pot1_Wiper: IC13.3(IN+) ; port Pot1_Wiper
Pot2_Filtered: C114.1 R64.2 ; port Pot2_Filtered
Pot2_Wiper: IC15.3(IN+) ; port Pot2_Wiper
Pot3_Filtered: C118.1 R66.2 ; port Pot3_Filtered
Pot3_Wiper: IC17.3(IN+) ; port Pot3_Wiper
Pot4_Filtered: C111.1 R63.2 ; port Pot4_Filtered
Pot4_Wiper: IC14.3(IN+) ; port Pot4_Wiper
Pot5_Filtered: C115.1 R65.2 ; port Pot5_Filtered
Pot5_Wiper: IC16.3(IN+) ; port Pot5_Wiper
Pot6_Filtered: C119.1 R67.2 ; port Pot6_Filtered
Pot6_Wiper: IC18.3(IN+) ; port Pot6_Wiper
Pot7_Filtered: C122.1 R70.2 ; port Pot7_Filtered
Pot7_Wiper: IC19.3(IN+) ; port Pot7_Wiper
Pot8_Filtered: C123.1 R71.2 ; port Pot8_Filtered
Pot8_Wiper: IC20.3(IN+) ; port Pot8_Wiper
NetIC13_1: IC13.1(OUT) IC13.4(IN-) R62.1
NetIC14_1: IC14.1(OUT) IC14.4(IN-) R63.1
NetIC15_1: IC15.1(OUT) IC15.4(IN-) R64.1
NetIC16_1: IC16.1(OUT) IC16.4(IN-) R65.1
NetIC17_1: IC17.1(OUT) IC17.4(IN-) R66.1
NetIC18_1: IC18.1(OUT) IC18.4(IN-) R67.1
NetIC19_1: IC19.1(OUT) IC19.4(IN-) R70.1
NetIC20_1: IC20.1(OUT) IC20.4(IN-) R71.1

### Library data of the parts
C108-C123 = CMP-06035-028957-1: Ceramic Capacitor for Automotive 100nF ±20% 50VDC X7R 0402 Paper T/R
IC13-IC20 = TLV9161IDBVR: Integrated Circuit; Manufacturer_Name: Texas Instruments; Datasheet Link: https://www.ti.com/lit/ds/symlink/tlv9161.pdf?HQS=dis-mous-null-mousermode-dsf-pf-null-wwe&ts=1675947383550&ref_url=https%253A%252F%252Fwww.mouser.de%252F; Height: 1.45mm; Manufacturer_Part_Number: TLV9161IDBVR; Mouser Part Number: 595-TLV9161IDBVR; Mouser Price/Stock: https://www.mouser.co.uk/ProductDetail/Texas-Instruments/TLV9161IDBVR?qs=Rp5uXu7WBW%2FkWJAGvxG3xQ%3D%3D; Arrow Part Number: TLV9161IDBVR; Arrow Price/Stock: https://www.arrow.com/en/products/tlv9161idbvr/texas-instruments?utm_currency=USD&region=nac
R62-R67 R70 R71 = CMP-2002-07914-1: Manufacturer: Yageo / Phycomp; Part Number: RC0402JR-07100RL

## Sheet MCU_Connections.SchDoc
size A3; SheetNumber: 2; SheetTotal: 13
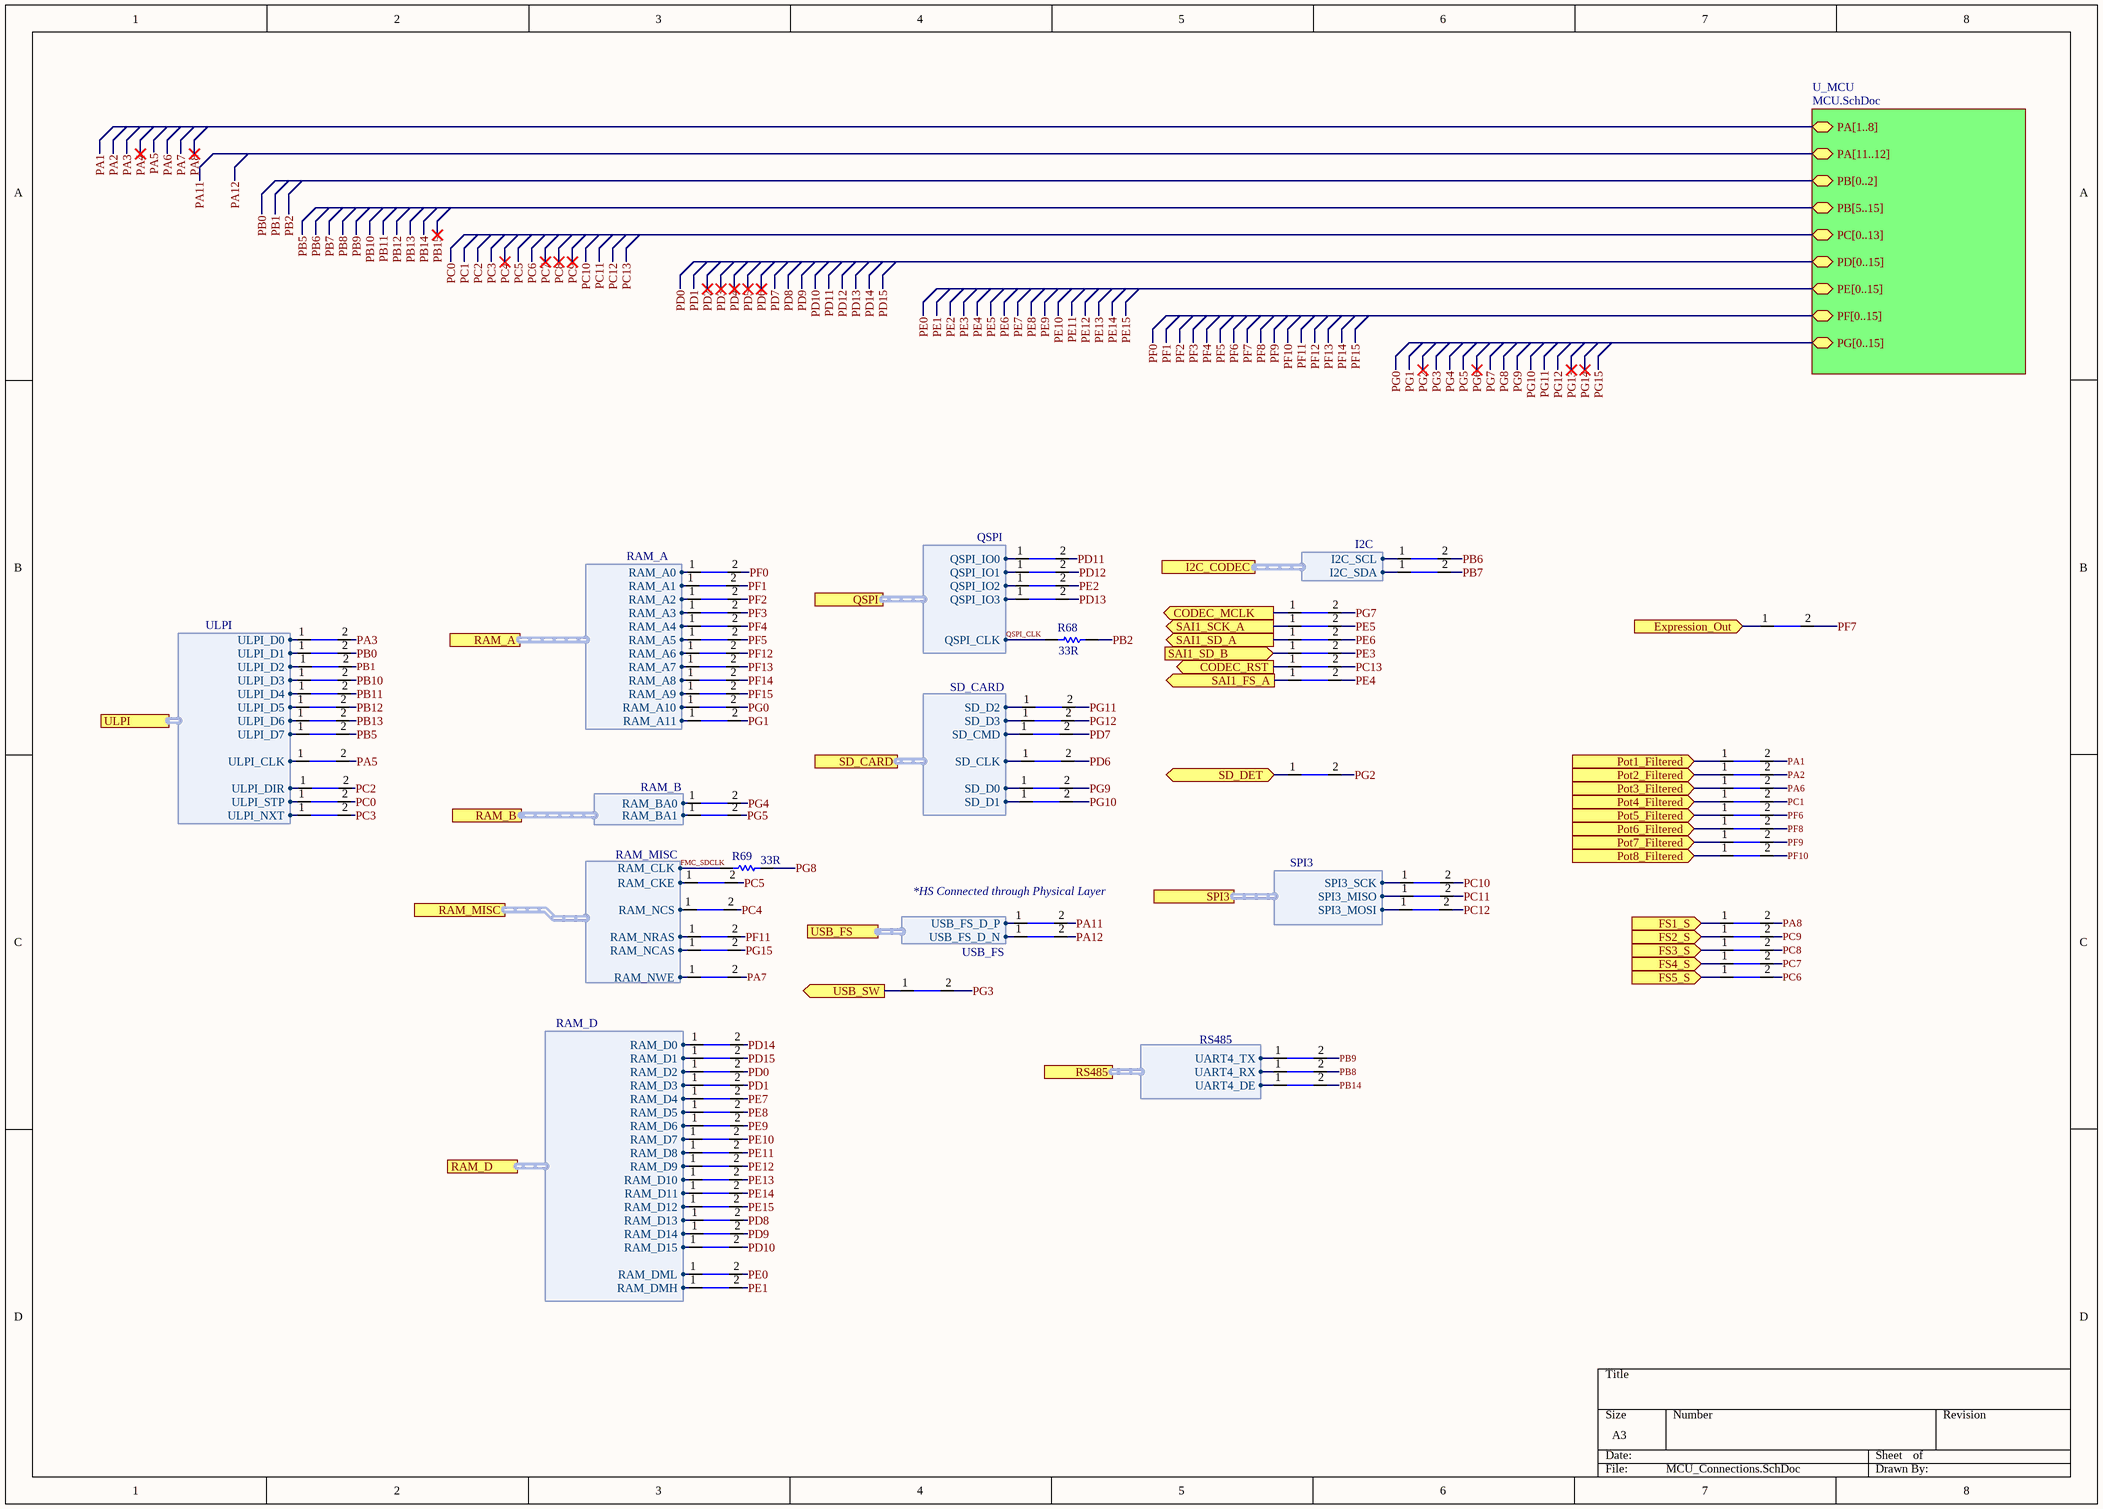
[diagram p9: MCU_Connections.SchDoc]

### Parts
NT1  NetTie_SMD  [NETTIE_SMD]  (value not drawn)  (net tie, no BOM)
NT2  NetTie_SMD  [NETTIE_SMD]  (value not drawn)  (net tie, no BOM)
NT3  NetTie_SMD  [NETTIE_SMD]  (value not drawn)  (net tie, no BOM)
NT4  NetTie_SMD  [NETTIE_SMD]  (value not drawn)  (net tie, no BOM)
NT5  NetTie_SMD  [NETTIE_SMD]  (value not drawn)  (net tie, no BOM)
NT6  NetTie_SMD  [NETTIE_SMD]  (value not drawn)  (net tie, no BOM)
NT7  NetTie_SMD  [NETTIE_SMD]  (value not drawn)  (net tie, no BOM)
NT8  NetTie_SMD  [NETTIE_SMD]  (value not drawn)  (net tie, no BOM)
NT9  NetTie_SMD  [NETTIE_SMD]  (value not drawn)  (net tie, no BOM)
NT10  NetTie_SMD  [NETTIE_SMD]  (value not drawn)  (net tie, no BOM)
NT11  NetTie_SMD  [NETTIE_SMD]  (value not drawn)  (net tie, no BOM)
NT12  NetTie_SMD  [NETTIE_SMD]  (value not drawn)  (net tie, no BOM)
NT13  NetTie_SMD  [NETTIE_SMD]  (value not drawn)  (net tie, no BOM)
NT14  NetTie_SMD  [NETTIE_SMD]  (value not drawn)  (net tie, no BOM)
NT15  NetTie_SMD  [NETTIE_SMD]  (value not drawn)  (net tie, no BOM)
NT16  NetTie_SMD  [NETTIE_SMD]  (value not drawn)  (net tie, no BOM)
NT17  NetTie_SMD  [NETTIE_SMD]  (value not drawn)  (net tie, no BOM)
NT18  NetTie_SMD  [NETTIE_SMD]  (value not drawn)  (net tie, no BOM)
NT19  NetTie_SMD  [NETTIE_SMD]  (value not drawn)  (net tie, no BOM)
NT20  NetTie_SMD  [NETTIE_SMD]  (value not drawn)  (net tie, no BOM)
NT21  NetTie_SMD  [NETTIE_SMD]  (value not drawn)  (net tie, no BOM)
NT22  NetTie_SMD  [NETTIE_SMD]  (value not drawn)  (net tie, no BOM)
NT23  NetTie_SMD  [NETTIE_SMD]  (value not drawn)  (net tie, no BOM)
NT24  NetTie_SMD  [NETTIE_SMD]  (value not drawn)  (net tie, no BOM)
NT25  NetTie_SMD  [NETTIE_SMD]  (value not drawn)  (net tie, no BOM)
NT26  NetTie_SMD  [NETTIE_SMD]  (value not drawn)  (net tie, no BOM)
NT27  NetTie_SMD  [NETTIE_SMD]  (value not drawn)  (net tie, no BOM)
NT28  NetTie_SMD  [NETTIE_SMD]  (value not drawn)  (net tie, no BOM)
NT29  NetTie_SMD  [NETTIE_SMD]  (value not drawn)  (net tie, no BOM)
NT30  NetTie_SMD  [NETTIE_SMD]  (value not drawn)  (net tie, no BOM)
NT31  NetTie_SMD  [NETTIE_SMD]  (value not drawn)  (net tie, no BOM)
NT32  NetTie_SMD  [NETTIE_SMD]  (value not drawn)  (net tie, no BOM)
NT33  NetTie_SMD  [NETTIE_SMD]  (value not drawn)  (net tie, no BOM)
NT34  NetTie_SMD  [NETTIE_SMD]  (value not drawn)  (net tie, no BOM)
NT35  NetTie_SMD  [NETTIE_SMD]  (value not drawn)  (net tie, no BOM)
NT36  NetTie_SMD  [NETTIE_SMD]  (value not drawn)  (net tie, no BOM)
NT37  NetTie_SMD  [NETTIE_SMD]  (value not drawn)  (net tie, no BOM)
NT38  NetTie_SMD  [NETTIE_SMD]  (value not drawn)  (net tie, no BOM)
NT39  NetTie_SMD  [NETTIE_SMD]  (value not drawn)  (net tie, no BOM)
NT40  NetTie_SMD  [NETTIE_SMD]  (value not drawn)  (net tie, no BOM)
NT41  NetTie_SMD  [NETTIE_SMD]  (value not drawn)  (net tie, no BOM)
NT42  NetTie_SMD  [NETTIE_SMD]  (value not drawn)  (net tie, no BOM)
NT43  NetTie_SMD  [NETTIE_SMD]  (value not drawn)  (net tie, no BOM)
NT44  NetTie_SMD  [NETTIE_SMD]  (value not drawn)  (net tie, no BOM)
NT45  NetTie_SMD  [NETTIE_SMD]  (value not drawn)  (net tie, no BOM)
NT46  NetTie_SMD  [NETTIE_SMD]  (value not drawn)  (net tie, no BOM)
NT47  NetTie_SMD  [NETTIE_SMD]  (value not drawn)  (net tie, no BOM)
NT48  NetTie_SMD  [NETTIE_SMD]  (value not drawn)  (net tie, no BOM)
NT49  NetTie_SMD  [NETTIE_SMD]  (value not drawn)  (net tie, no BOM)
NT50  NetTie_SMD  [NETTIE_SMD]  (value not drawn)  (net tie, no BOM)
NT51  NetTie_SMD  [NETTIE_SMD]  (value not drawn)  (net tie, no BOM)
NT52  NetTie_SMD  [NETTIE_SMD]  (value not drawn)  (net tie, no BOM)
NT53  NetTie_SMD  [NETTIE_SMD]  (value not drawn)  (net tie, no BOM)
NT54  NetTie_SMD  [NETTIE_SMD]  (value not drawn)  (net tie, no BOM)
NT55  NetTie_SMD  [NETTIE_SMD]  (value not drawn)  (net tie, no BOM)
NT56  NetTie_SMD  [NETTIE_SMD]  (value not drawn)  (net tie, no BOM)
NT57  NetTie_SMD  [NETTIE_SMD]  (value not drawn)  (net tie, no BOM)
NT58  NetTie_SMD  [NETTIE_SMD]  (value not drawn)  (net tie, no BOM)
NT59  NetTie_SMD  [NETTIE_SMD]  (value not drawn)  (net tie, no BOM)
NT60  NetTie_SMD  [NETTIE_SMD]  (value not drawn)  (net tie, no BOM)
NT61  NetTie_SMD  [NETTIE_SMD]  (value not drawn)  (net tie, no BOM)
NT62  NetTie_SMD  [NETTIE_SMD]  (value not drawn)  (net tie, no BOM)
NT63  NetTie_SMD  [NETTIE_SMD]  (value not drawn)  (net tie, no BOM)
NT64  NetTie_SMD  [NETTIE_SMD]  (value not drawn)  (net tie, no BOM)
NT65  NetTie_SMD  [NETTIE_SMD]  (value not drawn)  (net tie, no BOM)
NT66  NetTie_SMD  [NETTIE_SMD]  (value not drawn)  (net tie, no BOM)
NT67  NetTie_SMD  [NETTIE_SMD]  (value not drawn)  (net tie, no BOM)
NT68  NetTie_SMD  [NETTIE_SMD]  (value not drawn)  (net tie, no BOM)
NT69  NetTie_SMD  [NETTIE_SMD]  (value not drawn)  (net tie, no BOM)
NT70  NetTie_SMD  [NETTIE_SMD]  (value not drawn)  (net tie, no BOM)
NT71  NetTie_SMD  [NETTIE_SMD]  (value not drawn)  (net tie, no BOM)
NT72  NetTie_SMD  [NETTIE_SMD]  (value not drawn)  (net tie, no BOM)
NT73  NetTie_SMD  [NETTIE_SMD]  (value not drawn)  (net tie, no BOM)
NT74  NetTie_SMD  [NETTIE_SMD]  (value not drawn)  (net tie, no BOM)
NT75  NetTie_SMD  [NETTIE_SMD]  (value not drawn)  (net tie, no BOM)
NT76  NetTie_SMD  [NETTIE_SMD]  (value not drawn)  (net tie, no BOM)
NT77  NetTie_SMD  [NETTIE_SMD]  (value not drawn)  (net tie, no BOM)
NT78  NetTie_SMD  [NETTIE_SMD]  (value not drawn)  (net tie, no BOM)
NT79  NetTie_SMD  [NETTIE_SMD]  (value not drawn)  (net tie, no BOM)
NT80  NetTie_SMD  [NETTIE_SMD]  (value not drawn)  (net tie, no BOM)
NT81  NetTie_SMD  [NETTIE_SMD]  (value not drawn)  (net tie, no BOM)
NT82  NetTie_SMD  [NETTIE_SMD]  (value not drawn)  (net tie, no BOM)
NT83  NetTie_SMD  [NETTIE_SMD]  (value not drawn)  (net tie, no BOM)
NT84  NetTie_SMD  [NETTIE_SMD]  (value not drawn)  (net tie, no BOM)
NT85  NetTie_SMD  [NETTIE_SMD]  (value not drawn)  (net tie, no BOM)
NT86  NetTie_SMD  [NETTIE_SMD]  (value not drawn)  (net tie, no BOM)
NT87  NetTie_SMD  [NETTIE_SMD]  (value not drawn)  (net tie, no BOM)
NT88  NetTie_SMD  [NETTIE_SMD]  (value not drawn)  (net tie, no BOM)
NT89  NetTie_SMD  [NETTIE_SMD]  (value not drawn)  (net tie, no BOM)
NT90  NetTie_SMD  [NETTIE_SMD]  (value not drawn)  (net tie, no BOM)
NT91  NetTie_SMD  [NETTIE_SMD]  (value not drawn)  (net tie, no BOM)
R68  Resistance: 33R  [RESC1005X40X25ML05T10]  (hidden comment: RC0402JR-1333RL)
R69  Resistance: 33R  [RESC1005X40X25ML05T10]  (hidden comment: RC0402JR-1333RL)

### Sub-sheets
U_MCU = MCU.SchDoc: PA[1..8] (bidir), PA[11..12] (bidir), PB[0..2] (bidir), PB[5..15] (bidir), PC[0..13] (bidir), PD[0..15] (bidir), PE[0..15] (bidir), PF[0..15] (bidir), PG[0..15] (bidir)

### Ports
CODEC_MCLK (out, see high_level[5A], Codec[3B]), CODEC_RST (out, see high_level[5A], Codec[4A]), Expression_Out (in, see high_level[5A], Expression_Pedal[6B]), FS1_S (in, see high_level[4B], Footswitches[3C]), FS2_S (in, see high_level[4B], Footswitches[4C]), FS3_S (in, see high_level[4B], Footswitches[5C]), FS4_S (in, see high_level[4B], Footswitches[5C]), FS5_S (in, see high_level[4B], Footswitches[6C]), I2C_CODEC (harness I2C, see high_level[5A], Codec[2C]), Pot1_Filtered (in, see high_level[4B], Potentiometers[3B]), Pot2_Filtered (in, see high_level[4B], Potentiometers[3B]), Pot3_Filtered (in, see high_level[4B], Potentiometers[3C]), Pot4_Filtered (in, see high_level[4B], Potentiometers[6B]), Pot5_Filtered (in, see high_level[4B], Potentiometers[6B]), Pot6_Filtered (in, see high_level[4B], Potentiometers[6C]), Pot7_Filtered (in, see high_level[4B], Potentiometers[3D]), Pot8_Filtered (in, see high_level[4B], Potentiometers[6D]), QSPI (harness QSPI, see high_level[4A], Memory[5A]), RAM_A (harness RAM_A, see high_level[4A], Memory[1B]), RAM_B (harness RAM_B, see high_level[4A], Memory[1B]), RAM_D (harness RAM_D, see high_level[4A], Memory[4B]), RAM_MISC (harness RAM_MISC, see high_level[4A], Memory[1B]), RS485 (harness RS485, see high_level[5B], Peripherals[5A]), SAI1_FS_A (out, see high_level[5A], Codec[3B]), SAI1_SCK_A (out, see high_level[5A], Codec[3B]), SAI1_SD_A (out, see high_level[5A], Codec[3B]), SAI1_SD_B (in, see high_level[5A], Codec[3B]), SD_CARD (harness SD_CARD, see high_level[4A], Memory[1C]), SD_DET (bidir, see high_level[4A], Memory[5C]), SPI3 (harness SPI3, see high_level[4B], Peripherals[2D]), ULPI (harness ULPI, see high_level[5B], USB_HS[7B]), USB_FS (harness USB_FS, see high_level[5B], Peripherals[4B]), USB_SW (out, see high_level[5B], Peripherals[2B])

### Harnesses
ULPI: ULPI_D0, ULPI_D1, ULPI_D2, ULPI_D3, ULPI_D4, ULPI_D5, ULPI_D6, ULPI_D7, ULPI_CLK, ULPI_DIR, ULPI_STP, ULPI_NXT
RAM_A: RAM_A0, RAM_A1, RAM_A2, RAM_A3, RAM_A4, RAM_A5, RAM_A6, RAM_A7, RAM_A8, RAM_A9, RAM_A10, RAM_A11
RAM_B: RAM_BA0, RAM_BA1
RAM_MISC: RAM_CLK, RAM_CKE, RAM_NCS, RAM_NRAS, RAM_NCAS, RAM_NWE
RAM_D: RAM_D0, RAM_D1, RAM_D2, RAM_D3, RAM_D4, RAM_D5, RAM_D6, RAM_D7, RAM_D8, RAM_D9, RAM_D10, RAM_D11, RAM_D12, RAM_D13, RAM_D14, RAM_D15, RAM_DML, RAM_DMH
QSPI: QSPI_IO0, QSPI_IO1, QSPI_IO3, QSPI_CLK, QSPI_IO2
SD_CARD: SD_D2, SD_D3, SD_CMD, SD_CLK, SD_D0, SD_D1
USB_FS: USB_FS_D_P, USB_FS_D_N
I2C: I2C_SCL, I2C_SDA
SPI3: SPI3_SCK, SPI3_MISO, SPI3_MOSI
RS485: UART4_TX, UART4_RX, UART4_DE

### Nets
CODEC_MCLK: NT11.1 ; port CODEC_MCLK
CODEC_RST: NT23.1 ; port CODEC_RST
Expression_Out: NT14.1 ; port Expression_Out
FMC_SDCLK: R69.1 ; port RAM_MISC.RAM_CLK
FS_SIG1: NT61.1 ; port FS1_S
FS_SIG2: NT64.1 ; port FS2_S
FS_SIG3: NT66.1 ; port FS3_S
FS_SIG4: NT67.1 ; port FS4_S
FS_SIG5: NT69.1 ; port FS5_S
PA1: NT39.2
PA2: NT41.2
PA3: NT15.2
PA5: NT37.2
PA6: NT44.2
PA7: NT68.2
PA8: NT61.2
PA11: NT60.2
PA12: NT63.2
PB0: NT18.2
PB1: NT21.2
PB2: R68.2
PB5: NT35.2
PB6: NT2.2
PB7: NT5.2
PB8: NT75.2
PB9: NT73.2
PB10: NT24.2
PB11: NT27.2
PB12: NT29.2
PB13: NT32.2
PB14: NT77.2
PC0: NT45.2
PC1: NT48.2
PC2: NT42.2
PC3: NT49.2
PC4: NT58.2
PC5: NT55.2
PC6: NT69.2
PC7: NT67.2
PC8: NT66.2
PC9: NT64.2
PC10: NT56.2
PC11: NT57.2
PC12: NT59.2
PC13: NT23.2
PD0: NT74.2
PD1: NT76.2
PD6: NT38.2
PD7: NT36.2
PD8: NT87.2
PD9: NT88.2
PD10: NT89.2
PD11: NT1.2
PD12: NT4.2
PD13: NT9.2
PD14: NT71.2
PD15: NT72.2
PE0: NT90.2
PE1: NT91.2
PE2: NT7.2
PE3: NT20.2
PE4: NT26.2
PE5: NT13.2
PE6: NT17.2
PE7: NT78.2
PE8: NT79.2
PE9: NT80.2
PE10: NT81.2
PE11: NT82.2
PE12: NT83.2
PE13: NT84.2
PE14: NT85.2
PE15: NT86.2
PF0: NT3.2
PF1: NT6.2
PF2: NT8.2
PF3: NT10.2
PF4: NT12.2
PF5: NT16.2
PF6: NT51.2
PF7: NT14.2
PF8: NT52.2
PF9: NT53.2
PF10: NT54.2
PF11: NT62.2
PF12: NT19.2
PF13: NT22.2
PF14: NT25.2
PF15: NT28.2
PG0: NT30.2
PG1: NT33.2
PG2: NT40.2
PG3: NT70.2
PG4: NT46.2
PG5: NT50.2
PG7: NT11.2
PG8: R69.2
PG9: NT43.2
PG10: NT47.2
PG11: NT31.2
PG12: NT34.2
PG15: NT65.2
Pot1_Filtered: NT39.1 ; port Pot1_Filtered
Pot2_Filtered: NT41.1 ; port Pot2_Filtered
Pot3_Filtered: NT44.1 ; port Pot3_Filtered
Pot4_Filtered: NT48.1 ; port Pot4_Filtered
Pot5_Filtered: NT51.1 ; port Pot5_Filtered
Pot6_Filtered: NT52.1 ; port Pot6_Filtered
Pot7_Filtered: NT53.1 ; port Pot7_Filtered
Pot8_Filtered: NT54.1 ; port Pot8_Filtered
QSPI_CLK: R68.1 ; port QSPI.QSPI_CLK
QSPI_IO0: NT1.1 ; port QSPI.QSPI_IO0
QSPI_IO2: NT7.1 ; port QSPI.QSPI_IO2
QSPI_IO3: NT9.1 ; port QSPI.QSPI_IO3
RAM_A0: NT3.1 ; port RAM_A.RAM_A0
RAM_A1: NT6.1 ; port RAM_A.RAM_A1
RAM_A2: NT8.1 ; port RAM_A.RAM_A2
RAM_A3: NT10.1 ; port RAM_A.RAM_A3
RAM_A4: NT12.1 ; port RAM_A.RAM_A4
RAM_A5: NT16.1 ; port RAM_A.RAM_A5
RAM_A6: NT19.1 ; port RAM_A.RAM_A6
RAM_A7: NT22.1 ; port RAM_A.RAM_A7
RAM_A8: NT25.1 ; port RAM_A.RAM_A8
RAM_A9: NT28.1 ; port RAM_A.RAM_A9
RAM_A10: NT30.1 ; port RAM_A.RAM_A10
RAM_A11: NT33.1 ; port RAM_A.RAM_A11
RAM_BA0: NT46.1 ; port RAM_B.RAM_BA0
RAM_BA1: NT50.1 ; port RAM_B.RAM_BA1
RAM_CKE: NT55.1 ; port RAM_MISC.RAM_CKE
RAM_D0: NT71.1 ; port RAM_D.RAM_D0
RAM_D1: NT72.1 ; port RAM_D.RAM_D1
RAM_D2: NT74.1 ; port RAM_D.RAM_D2
RAM_D3: NT76.1 ; port RAM_D.RAM_D3
RAM_D4: NT78.1 ; port RAM_D.RAM_D4
RAM_D5: NT79.1 ; port RAM_D.RAM_D5
RAM_D6: NT80.1 ; port RAM_D.RAM_D6
RAM_D7: NT81.1 ; port RAM_D.RAM_D7
RAM_D8: NT82.1 ; port RAM_D.RAM_D8
RAM_D9: NT83.1 ; port RAM_D.RAM_D9
RAM_D10: NT84.1 ; port RAM_D.RAM_D10
RAM_D11: NT85.1 ; port RAM_D.RAM_D11
RAM_D12: NT86.1 ; port RAM_D.RAM_D12
RAM_D13: NT87.1 ; port RAM_D.RAM_D13
RAM_D14: NT88.1 ; port RAM_D.RAM_D14
RAM_D15: NT89.1 ; port RAM_D.RAM_D15
RAM_DMH: NT91.1 ; port RAM_D.RAM_DMH
RAM_DML: NT90.1 ; port RAM_D.RAM_DML
RAM_NCAS: NT65.1 ; port RAM_MISC.RAM_NCAS
RAM_NCS: NT58.1 ; port RAM_MISC.RAM_NCS
RAM_NRAS: NT62.1 ; port RAM_MISC.RAM_NRAS
RAM_NWE: NT68.1 ; port RAM_MISC.RAM_NWE
SAI1_FS_A: NT26.1 ; port SAI1_FS_A
SAI1_SCK_A: NT13.1 ; port SAI1_SCK_A
SAI1_SD_A: NT17.1 ; port SAI1_SD_A
SAI1_SD_B: NT20.1 ; port SAI1_SD_B
SD_CLK: NT38.1 ; port SD_CARD.SD_CLK
SD_CMD: NT36.1 ; port SD_CARD.SD_CMD
SD_D0: NT43.1 ; port SD_CARD.SD_D0
SD_D1: NT47.1 ; port SD_CARD.SD_D1
SD_D2: NT31.1 ; port SD_CARD.SD_D2
SD_D3: NT34.1 ; port SD_CARD.SD_D3
SD_DET: NT40.1 ; port SD_DET
SPI3_MISO: NT57.1 ; port SPI3.SPI3_MISO
SPI3_MOSI: NT59.1 ; port SPI3.SPI3_MOSI
SPI3_SCK: NT56.1 ; port SPI3.SPI3_SCK
USB_FS_D_N: NT63.1 ; port USB_FS.USB_FS_D_N
USB_FS_D_P: NT60.1 ; port USB_FS.USB_FS_D_P
USB_SW: NT70.1 ; port USB_SW
NetIC1_8: NT35.1 ; port ULPI.ULPI_D7
NetIC1_9: NT32.1 ; port ULPI.ULPI_D6
NetIC1_10: NT29.1 ; port ULPI.ULPI_D5
NetIC1_11: NT27.1 ; port ULPI.ULPI_D4
NetIC1_12: NT37.1 ; port ULPI.ULPI_CLK
NetIC1_13: NT24.1 ; port ULPI.ULPI_D3
NetIC1_14: NT21.1 ; port ULPI.ULPI_D2
NetIC1_15: NT18.1 ; port ULPI.ULPI_D1
NetIC1_16: NT15.1 ; port ULPI.ULPI_D0
NetIC1_18: NT49.1 ; port ULPI.ULPI_NXT
NetIC1_19: NT42.1 ; port ULPI.ULPI_DIR
NetIC1_20: NT45.1 ; port ULPI.ULPI_STP
NetIC3_8: NT2.1 ; port I2C_CODEC.I2C_SCL
NetIC3_9: NT5.1 ; port I2C_CODEC.I2C_SDA
NetIC10_2: NT4.1 ; port QSPI.QSPI_IO1
NetIC21_1: NT73.1 ; port RS485.UART4_TX
NetIC21_2: NT77.1 ; port RS485.UART4_DE
NetIC21_4: NT75.1 ; port RS485.UART4_RX

### Notes on the sheet
- *HS Connected through Physical Layer

### Library data of the parts
NT1-NT91 = CMP-026-000007-1: Net Tie; altium.hash: E97C61A79E216CA6C80CDA4F77C18B20; Design Item ID: NetTie_SMD; Source: HotBoardReal.SCHLIB
R68 R69 = CMP-2002-08082-1: Manufacturer: Yageo; Part Number: RC0402JR-1333RL

## Sheet MCU.SchDoc
size A3; SheetNumber: 3; SheetTotal: 13
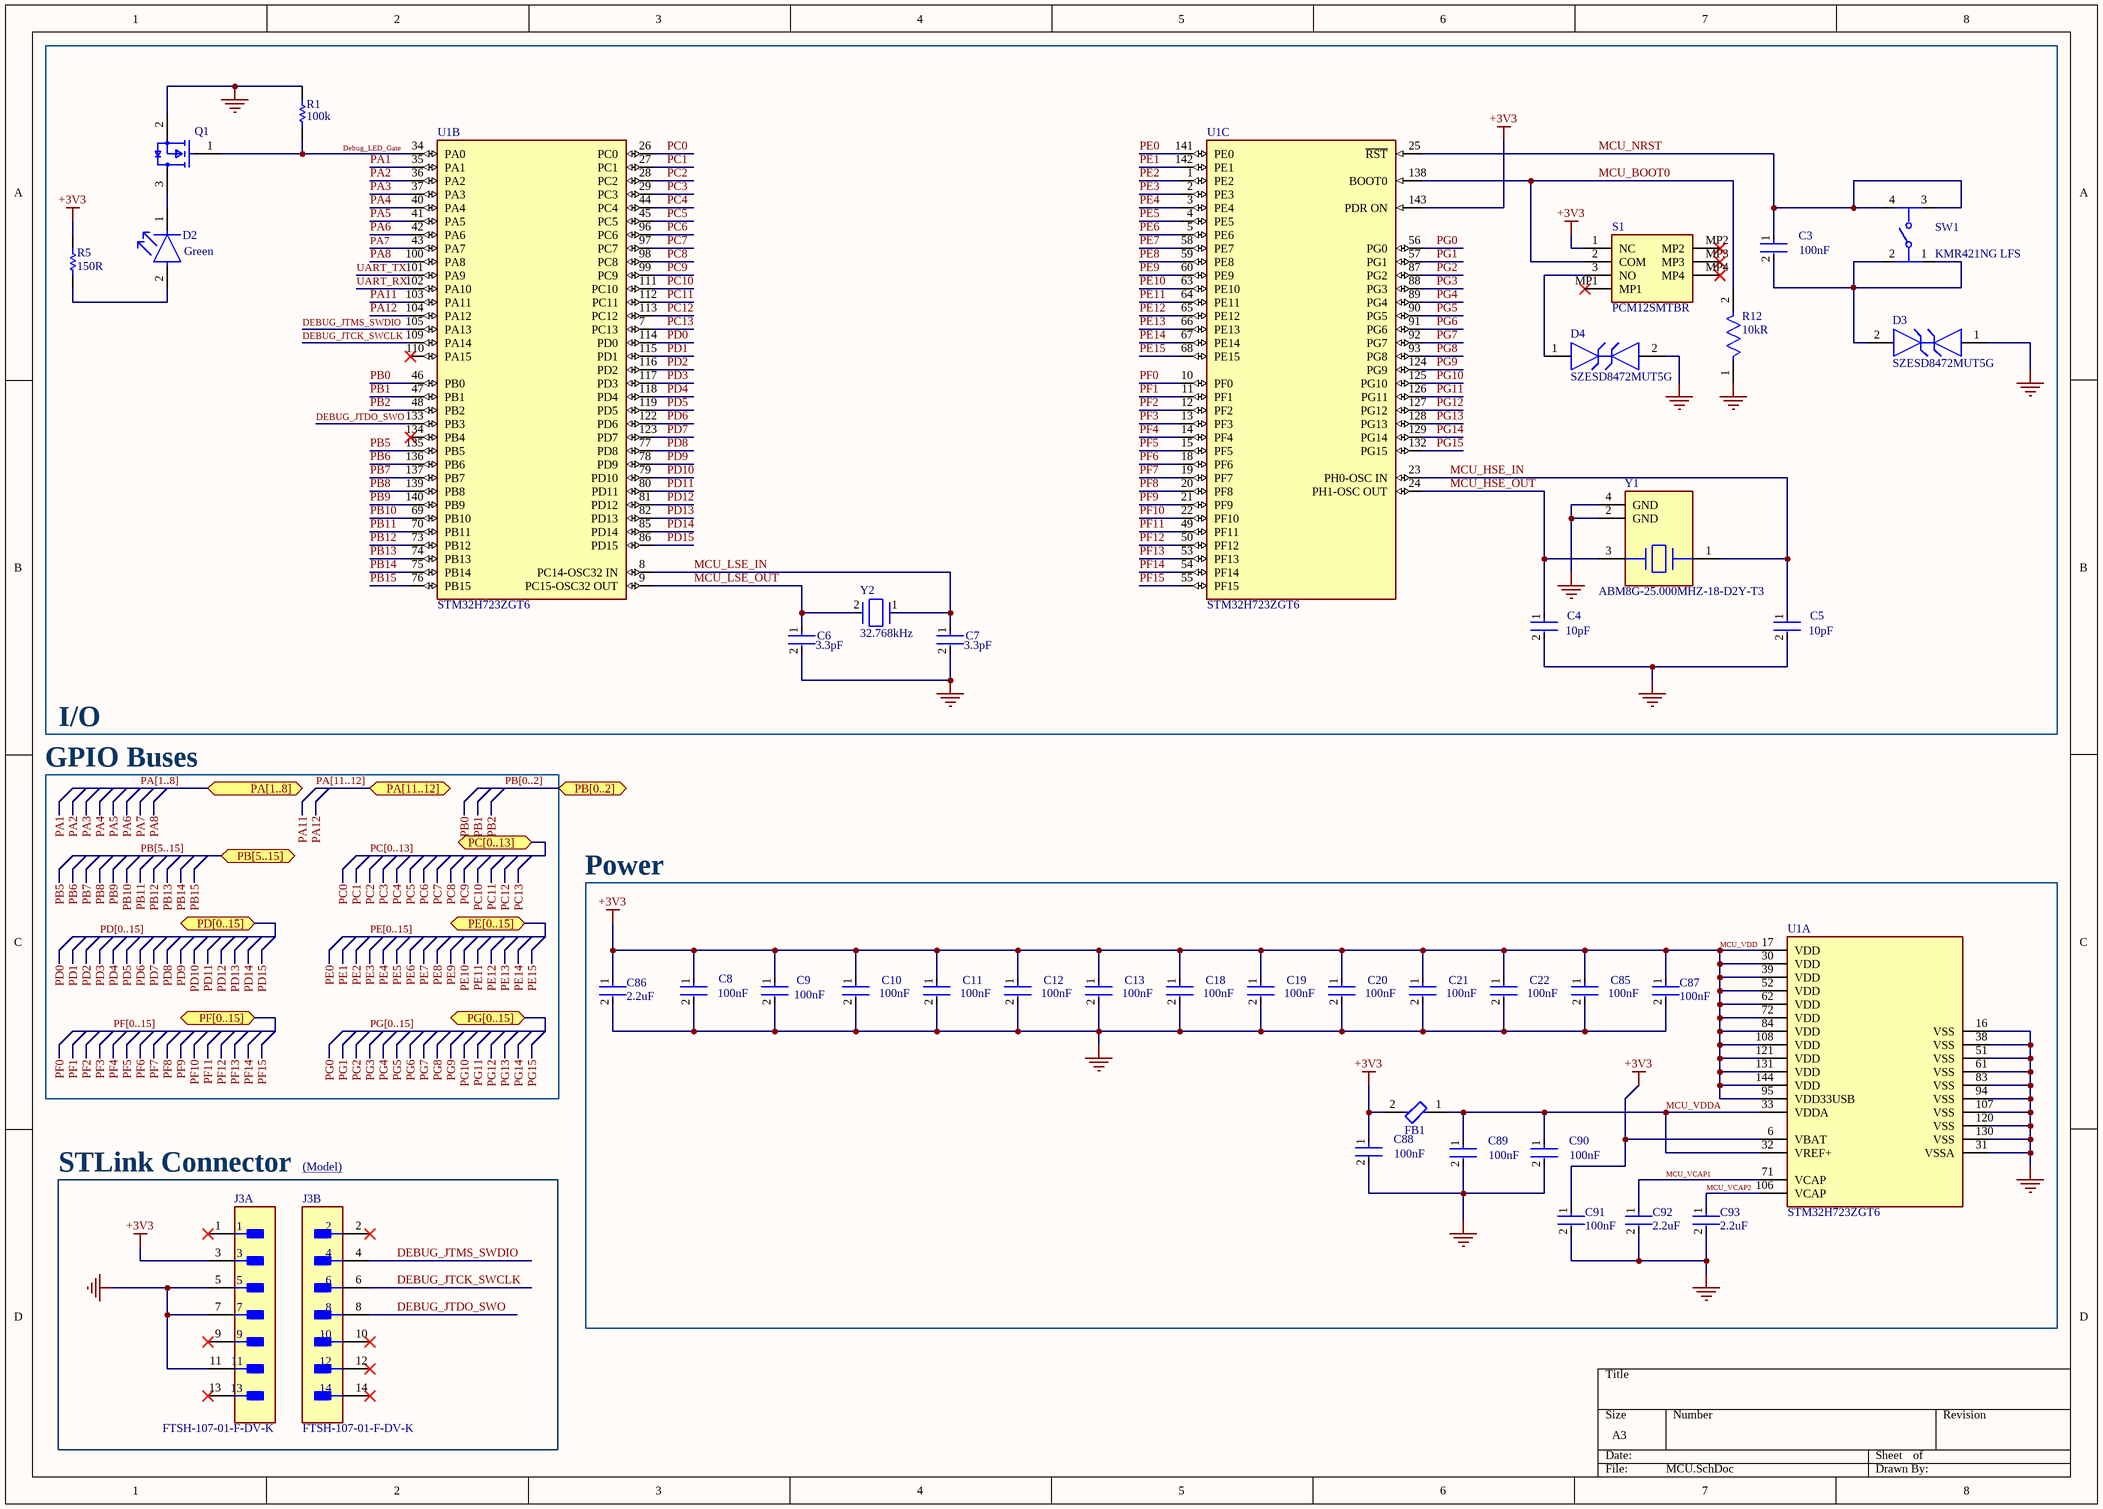
[diagram p10: MCU.SchDoc]

### Parts
C3  Capacitance: 100nF  [FP-GCM155-0_05-IPC_A]  (hidden comment: GCM155R71H104ME02J)
C4  Capacitance: 10pF  [FP-GCM155-0_05-IPC_B]  (hidden comment: GCM1555G1H100GA16D)
C5  Capacitance: 10pF  [FP-GCM155-0_05-IPC_B]  (hidden comment: GCM1555G1H100GA16D)
C6  Capacitance: 3.3pF  [FP-GCM155-0_05-IPC_C]  (hidden comment: GCM1555C1H3R3CA16J)
C7  Capacitance: 3.3pF  [FP-GCM155-0_05-IPC_C]  (hidden comment: GCM1555C1H3R3CA16J)
C8  Capacitance: 100nF  [FP-GCM155-0_05-IPC_A]  (hidden comment: GCM155R71H104ME02J)
C9  Capacitance: 100nF  [FP-GCM155-0_05-IPC_A]  (hidden comment: GCM155R71H104ME02J)
C10  Capacitance: 100nF  [FP-GCM155-0_05-IPC_A]  (hidden comment: GCM155R71H104ME02J)
C11  Capacitance: 100nF  [FP-GCM155-0_05-IPC_A]  (hidden comment: GCM155R71H104ME02J)
C12  Capacitance: 100nF  [FP-GCM155-0_05-IPC_A]  (hidden comment: GCM155R71H104ME02J)
C13  Capacitance: 100nF  [FP-GCM155-0_05-IPC_A]  (hidden comment: GCM155R71H104ME02J)
C18  Capacitance: 100nF  [FP-GCM155-0_05-IPC_A]  (hidden comment: GCM155R71H104ME02J)
C19  Capacitance: 100nF  [FP-GCM155-0_05-IPC_A]  (hidden comment: GCM155R71H104ME02J)
C20  Capacitance: 100nF  [FP-GCM155-0_05-IPC_A]  (hidden comment: GCM155R71H104ME02J)
C21  Capacitance: 100nF  [FP-GCM155-0_05-IPC_A]  (hidden comment: GCM155R71H104ME02J)
C22  Capacitance: 100nF  [FP-GCM155-0_05-IPC_A]  (hidden comment: GCM155R71H104ME02J)
C85  Capacitance: 100nF  [FP-GCM155-0_05-IPC_A]  (hidden comment: GCM155R71H104ME02J)
C86  Capacitance: 2.2uF  [FP-GCH188-0_1-e0_2_0_5-MFG]  (hidden comment: GCM188C71A225KE02D)
C87  Capacitance: 100nF  [FP-GCM155-0_05-IPC_A]  (hidden comment: GCM155R71H104ME02J)
C88  Capacitance: 100nF  [FP-GCM155-0_05-IPC_A]  (hidden comment: GCM155R71H104ME02J)
C89  Capacitance: 100nF  [FP-GCM155-0_05-IPC_A]  (hidden comment: GCM155R71H104ME02J)
C90  Capacitance: 100nF  [FP-GCM155-0_05-IPC_A]  (hidden comment: GCM155R71H104ME02J)
C91  Capacitance: 100nF  [FP-GCM155-0_05-IPC_A]  (hidden comment: GCM155R71H104ME02J)
C92  Capacitance: 2.2uF  [FP-GCH188-0_1-e0_2_0_5-MFG]  (hidden comment: GCM188C71A225KE02D)
C93  Capacitance: 2.2uF  [FP-GCH188-0_1-e0_2_0_5-MFG]  (hidden comment: GCM188C71A225KE02D)
D2  Colour: Green  [FP-SML-P1-MFG]  (hidden comment: SML-P13PTT86R)
D3  SZESD8472MUT5G  [FP-152AF-MFG]
D4  SZESD8472MUT5G  [FP-152AF-MFG]
FB1  BLM15BX102SZ1D  [FP-BLM15-0_05-MFG]  (value not drawn)
J3  FTSH-107-01-F-DV-K  [FP-FTSH-107-01-F-DV-K-MFG]  (parts A,B of 2)
Q1  2N7002H6327XTSA2  [FP-PG-SOT23-3-MFG]  (value not drawn)
R1  Resistance: 100k  [RESC1005X40X25NL05T10]  (hidden comment: RC0402FR-07100KL)
R5  Resistance: 150R  [RESC1005X40X25LL05T10]  (hidden comment: RC0402JR-13150RL)
R12  Resistance: 10kR  [FP-RC0402-0_4-IPC_A]  (hidden comment: RC0402FR-1310KL)
S1  PCM12SMTBR  [PCM12SMTBR]
SW1  KMR421NG LFS  [FP-KMR421NG_LFS-MFG]
U1  STM32H723ZGT6  [FP-LQFP144-1A-IPC_A]  (parts A,B,C of 3)
Y1  ABM8G-25.000MHZ-18-D2Y-T3  [FP-ABM8G-MFG]
Y2  Frequency: 32.768kHz  [FP-ECX-34Q-MFG]  (hidden comment: ECS-.327-6-34QCN-TR)

### Blocks framed on the sheet
I/O: C3-C7 D2-D4 Q1 R1 R5 R12 S1 SW1 U1 Y1 Y2
Power: C8-C13 C18-C22 C85-C93 FB1 U1
STLink Connector: J3

### Ports
PA[1..8] (bidir, see MCU_Connections[7A]), PA[11..12] (bidir, see MCU_Connections[7A]), PB[0..2] (bidir, see MCU_Connections[7A]), PB[5..15] (bidir, see MCU_Connections[7A]), PC[0..13] (bidir, see MCU_Connections[7A]), PD[0..15] (bidir, see MCU_Connections[7A]), PE[0..15] (bidir, see MCU_Connections[7A]), PF[0..15] (bidir, see MCU_Connections[7A]), PG[0..15] (bidir, see MCU_Connections[7A])

### Nets
+3V3: C8.1 C9.1 C10.1 C11.1 C12.1 C13.1 C18.1 C19.1 C20.1 C21.1 C22.1 C85.1 C86.1 C87.1 C88.1 C91.1 FB1.2 J3.3 R5.2 S1.1(NC) U1.6(VBAT) U1.17(VDD) U1.30(VDD) U1.39(VDD) U1.52(VDD) U1.62(VDD) U1.72(VDD) U1.84(VDD) U1.95(VDD33USB) U1.108(VDD) U1.121(VDD) U1.131(VDD) U1.143(PDR_ON) U1.144(VDD)  [also labelled MCU_VDD]
GND: C4.2 C5.2 C6.2 C7.2 C8.2 C9.2 C10.2 C11.2 C12.2 C13.2 C18.2 C19.2 C20.2 C21.2 C22.2 C85.2 C86.2 C87.2 C88.2 C89.2 C90.2 C91.2 C92.2 C93.2 D3.1 D4.2 J3.5 J3.7 J3.11 Q1.2(source) R1.2 R12.1 U1.16(VSS) U1.31(VSSA) U1.38(VSS) U1.51(VSS) U1.61(VSS) U1.83(VSS) U1.94(VSS) U1.107(VSS) U1.120(VSS) U1.130(VSS) Y1.2(GND) Y1.4(GND)
DEBUG_JTCK_SWCLK: J3.6 U1.109(PA14)
DEBUG_JTDO_SWO: J3.8 U1.133(PB3)
DEBUG_JTMS_SWDIO: J3.4 U1.105(PA13)
Debug_LED_Gate: Q1.1(gate) R1.1 U1.34(PA0)
MCU_BOOT0: R12.2 S1.2(COM) U1.138(BOOT0)
MCU_HSE_IN: C5.1 U1.23(PH0-OSC_IN) Y1.1
MCU_HSE_OUT: C4.1 U1.24(PH1-OSC_OUT) Y1.3
MCU_LSE_IN: C7.1 U1.8(PC14-OSC32_IN) Y2.1(In/Out)
MCU_LSE_OUT: C6.1 U1.9(PC15-OSC32_OUT) Y2.2(Out/In)
MCU_NRST: C3.1 SW1.3 SW1.4 U1.25(~{RST})
MCU_VCAP1: C92.1 U1.71(VCAP)
MCU_VCAP2: C93.1 U1.106(VCAP)
MCU_VDDA: C89.1 C90.1 FB1.1 U1.32(VREF+) U1.33(VDDA)
PA1: U1.35(PA1)
PA2: U1.36(PA2)
PA3: U1.37(PA3)
PA4: U1.40(PA4)
PA5: U1.41(PA5)
PA6: U1.42(PA6)
PA7: U1.43(PA7)
PA8: U1.100(PA8)
PA11: U1.103(PA11)
PA12: U1.104(PA12)
PB0: U1.46(PB0)
PB1: U1.47(PB1)
PB2: U1.48(PB2)
PB5: U1.135(PB5)
PB6: U1.136(PB6)
PB7: U1.137(PB7)
PB8: U1.139(PB8)
PB9: U1.140(PB9)
PB10: U1.69(PB10)
PB11: U1.70(PB11)
PB12: U1.73(PB12)
PB13: U1.74(PB13)
PB14: U1.75(PB14)
PB15: U1.76(PB15)
PC0: U1.26(PC0)
PC1: U1.27(PC1)
PC2: U1.28(PC2)
PC3: U1.29(PC3)
PC4: U1.44(PC4)
PC5: U1.45(PC5)
PC6: U1.96(PC6)
PC7: U1.97(PC7)
PC8: U1.98(PC8)
PC9: U1.99(PC9)
PC10: U1.111(PC10)
PC11: U1.112(PC11)
PC12: U1.113(PC12)
PC13: U1.7(PC13)
PD0: U1.114(PD0)
PD1: U1.115(PD1)
PD2: U1.116(PD2)
PD3: U1.117(PD3)
PD4: U1.118(PD4)
PD5: U1.119(PD5)
PD6: U1.122(PD6)
PD7: U1.123(PD7)
PD8: U1.77(PD8)
PD9: U1.78(PD9)
PD10: U1.79(PD10)
PD11: U1.80(PD11)
PD12: U1.81(PD12)
PD13: U1.82(PD13)
PD14: U1.85(PD14)
PD15: U1.86(PD15)
PE0: U1.141(PE0)
PE1: U1.142(PE1)
PE2: U1.1(PE2)
PE3: U1.2(PE3)
PE4: U1.3(PE4)
PE5: U1.4(PE5)
PE6: U1.5(PE6)
PE7: U1.58(PE7)
PE8: U1.59(PE8)
PE9: U1.60(PE9)
PE10: U1.63(PE10)
PE11: U1.64(PE11)
PE12: U1.65(PE12)
PE13: U1.66(PE13)
PE14: U1.67(PE14)
PE15: U1.68(PE15)
PF0: U1.10(PF0)
PF1: U1.11(PF1)
PF2: U1.12(PF2)
PF3: U1.13(PF3)
PF4: U1.14(PF4)
PF5: U1.15(PF5)
PF6: U1.18(PF6)
PF7: U1.19(PF7)
PF8: U1.20(PF8)
PF9: U1.21(PF9)
PF10: U1.22(PF10)
PF11: U1.49(PF11)
PF12: U1.50(PF12)
PF13: U1.53(PF13)
PF14: U1.54(PF14)
PF15: U1.55(PF15)
PG0: U1.56(PG0)
PG1: U1.57(PG1)
PG2: U1.87(PG2)
PG3: U1.88(PG3)
PG4: U1.89(PG4)
PG5: U1.90(PG5)
PG6: U1.91(PG6)
PG7: U1.92(PG7)
PG8: U1.93(PG8)
PG9: U1.124(PG9)
PG10: U1.125(PG10)
PG11: U1.126(PG11)
PG12: U1.127(PG12)
PG13: U1.128(PG13)
PG14: U1.129(PG14)
PG15: U1.132(PG15)
UART_RX: U1.102(PA10)
UART_TX: U1.101(PA9)
NetC3_2: C3.2 D3.2 SW1.1 SW1.2
NetD2_1: D2.1(C) Q1.3(drain)
NetD2_2: D2.2(A) R5.1
NetD4_1: D4.1 S1.3(NO)

Not connected (* = marked no-connect by the designer): J3 1* 2* 9* 10* 12* 13* 14*; S1 MP1* MP2* MP3* MP4*; U1 110(PA15)* 134(PB4)*

### Buses and harness runs
bus PA[1..8] = port PA[1..8]
bus PA[11..12] = port PA[11..12]
bus PB[0..2] = port PB[0..2]
bus PB[5..15] = port PB[5..15]
bus PC[0..13] = port PC[0..13]
bus PD[0..15] = port PD[0..15]
bus PE[0..15] = port PE[0..15]
bus PF[0..15] = port PF[0..15]
bus PG[0..15] = port PG[0..15]

### Notes on the sheet
- GPIO Buses
- (Model) <https://au.mouser.com/ProductDetail/STMicroelectronics/STLINK-V3MINIE?qs=MyNHzdoqoQKcLQe5Jawcgw%3D%3D>

### Library data of the parts
C3 C8-C13 C18-C22 C85 C87-C91 = CMP-06035-028957-1: as C108-C123 on sheet Potentiometers
C4 C5 = CMP-06035-053638-1: Ceramic Capacitor for Automotive 10pF ±2% 50VDC X8G 0402 Paper T/R
C6 C7 = CMP-06035-005325-1: Ceramic Capacitor for Automotive 3.3pF ±0.25pF 50VDC C0G 0402 Paper T/R; Voltage Rating (DC): 50V; Packaging: Tape and Reel; Max Operating Temperature: 125°C; Length: 0.039inch; Min Operating Temperature: -55°C; Ratings: AEC-Q200; Voltage Rating: 50V; Case Code (Metric): 1005; Width: 0.5mm; Case/Package: 0402; Height: 0.5mm; Weight: 0.000212oz; Mount: Surface Mount; Termination: SMD/SMT; Thickness: 0.022inch; Package Quantity: 50000; Dielectric: C0G; Case Code (Imperial): 0402
C86 C92 C93 = CMP-00260-57357036-1: GCM188C71A225KE02D Multilayer Ceramic Capacitor, 2.2 uF, 10 V, ± 10%, X7S, 0603 [1608 Metric]; NexarPartId: 57357036; RoHS: Non-Compliant; Lifecycle Status: Production
D2 = CMP-08952-000015-1: LED GREEN CLEAR 1006 SMD; Manufacturer: Rohm; Power Dissipation: 52mW; Forward Current: 20mA; Reverse Voltage: 5V; Led Orientation: Top View; Forward Voltage: 2.1V; Luminous Intensity: 10mcd; Wavelength: 560nm; Temperature: -40°C to +85°C; Digikey Description: LED GREEN CLEAR 1006 SMD; Manufacturer Part Number: SML-P13PTT86R; Lead Free: Yes; Height: 0.25mm; Package: SML-P1; RoHS: TRUE; Mouser Description: LED Uni-Color Green 2-Pin Chip 0402(1006Metric) T/R; Device Class L2: LEDs; ComponentLink2URL: https://d1d2qsbl8m0m72.cloudfront.net/en/products/databook/datasheet/opto/led/chip_mono/sml-p1-e.pdf; Device Class L1: Optoelectronics; ComponentLink2Description: Datasheet; Category: Diode; Temperature Range High: +85°C; Automotive: No; Temperature Range Low: -40°C; Octopart: https://octopart.com/sml-p13ptt86r-rohm-59370256; Device Class L3: unset
D3 D4 = CMP-07200-000010-1: TVS DIODE 5.3V 14V 2X3DFN; Number of Bidirectional Channels: 1; Element Configuration: Single; Capacitance: 0.3pF; Peak Pulse Current: 3A; Power Line Protection: No; Min Breakdown Voltage: 7V; Direction: Bidirectional; Case/Package: DFN; Lead Free: Lead Free; Reverse Standoff Voltage: 5.3V; Clamping Voltage: 14V; Resistor Type: Zener; Packaging: Tape and Reel; Mount: Surface Mount; Number of Pins: 2; Max Operating Temperature: 150°C; Min Operating Temperature: -55°C; Working Voltage: 5.3V; RoHS Compliant: Yes
FB1 = CMP-06046-001231-1: Chip Ferrite Bead, 0402, 1000Ω @ 100MHz, 0.65Ω, 25%, 300mA
J3 = CMP-02766-001448-1: CONN HEADER SMD 14POS 1.27MM; Gender: Male; Connector Type: Male Pin; Number of Contacts: 14; Row Spacing: 0.05inch; Min Operating Temperature: -55°C; Package Quantity: 1; Lead Free: Lead Free; RoHS Compliant: Yes; Contact Material: Bronze; Contact Plating: Gold; Number of Rows: 2; Housing Material: Polymer; Contact Type: Male Pin; Series: FTSH; Max Operating Temperature: 125°C; Orientation: Straight; Number of Positions: 14; Pitch: 1.27mm; Housing Color: Black; Color: Black; Radiation Hardening: No; Length: 8.89mm; Termination: Solder; Packaging: Rail/Tube; Depth: 5.84mm; Mount: Surface Mount; Contact Mating Length: 0.12inch
Q1 = CMP-32901-000180-1: MOSFET N-CH 60V 0.3A SOT23; Rise Time: 3.3ns; Input Capacitance: 20pF; Rds On Max: 3R; Gate to Source Voltage (Vgs): 20V; Continuous Drain Current (ID): 300mA; Max Power Dissipation: 500mW; Packaging: Tape and Reel; Mount: Surface Mount; Case/Package: SOT-23; Drain to Source Voltage (Vdss): 60V; Min Operating Temperature: -55°C; Halogen Free: Halogen Free; Max Dual Supply Voltage: 60V; Number of Pins: 3; Lead Free: Lead Free; Max Operating Temperature: 150°C
R1 = CMP-2002-07343-1: Manufacturer: Yageo / Phycomp; Part Number: RC0402FR-07100KL
R5 = CMP-2002-08067-1: Manufacturer: Yageo; Part Number: RC0402JR-13150RL
R12 = CMP-2002-07854-2: RESISTOR 0402 10K 1%; Power Rating: 62.5mW; Voltage Rating (DC): 50V; Temperature Coefficient: 100ppm/°C; REACH SVHC: No SVHC; Case/Package: 0402; Termination: SMD/SMT; Max Operating Temperature: 155°C; Contact Plating: Tin; Resistance Tolerance: 1%; Radiation Hardening: No; Voltage Rating: 50V; Lead Free: Lead Free; Length: 1mm; Depth: 0.5mm; Number of Pins: 2; RoHS Compliant: Yes; Case Code (Imperial): 0402; Case Code (Metric): 1005; Min Operating Temperature: -55°C; Packaging: Tape and Reel; Technology: THICK FILM; Series: RC; Number of Terminations: 2; Resistor Type: Thick Film; Tolerance: 1%; Working Voltage: 50V; Military Standard: Not; Construction: Rectangular
S1 = PCM12SMTBR: Switch; Manufacturer_Name: C & K COMPONENTS; Datasheet Link: https://www.ckswitches.com/media/1424/pcm.pdf; Height: 1.4mm; Manufacturer_Part_Number: PCM12SMTBR; Mouser Part Number: 611-PCM12SMTBR; Mouser Price/Stock: https://www.mouser.co.uk/ProductDetail/CK/PCM12SMTBR?qs=By6Nw2ByBD1OEOnWcdZb2g%3D%3D; Arrow Part Number: PCM12SMTBR; Arrow Price/Stock: https://www.arrow.com/en/products/pcm12smtbr/ck?utm_currency=USD&region=europe
SW1 = CMP-10040-000003-1: SWITCH TACTILE SPST-NO 0.05A 32V; Manufacturer: C&K Components; Contact Resistance: 100mΩ; Operating Force: 2N; Current Rating: 50mA; Electromechanical Life: 100000Cycles; ComponentLink2URL: https://www.ckswitches.com/media/1480/kmr4.pdf; Automotive: No; Device Class L2: Switches; Temperature Range Low: -40°C; Temperature: -40°C to +85°C; Digikey Description: SWITCH TACTILE SPST-NO 0.05A 32V; Category: Switch; ComponentLink2Description: Datasheet; Octopart: https://octopart.com/kmr421nglfs-c%26k+components-7226706; Mouser Description: Switch Tactile N.O. SPST Round Button Gull Wing 0.05A 32VDC 1VA 2N SMD Automotive T/R; Package: KMR421NG LFS; Manufacturer Part Number: KMR421NG LFS; Lead Free: Yes; Throw Configuration: SPST-NO; Height: 2.5mm; Device Class L3: Tactile Switches; Mount: Surface Mount; Device Class L1: Electromechanical; RoHS: TRUE; Temperature Range High: +85°C; Voltage Rating Dc: 32V
U1 = CMP-12105-000148-1: IC MCU 32BIT 1MB FLASH 144LQFP
Y1 = CMP-27762-015132-1: Crystal 25MHz ±20ppm (Tol) ±30ppm (Stability) 18pF FUND 60Ω 4-Pin SMD T/R; ESR (Equivalent Series Resistance): 60R; Termination: SMD/SMT; Series: ABM8G; Max Operating Temperature: 85°C; Width: 2.5mm; Radiation Hardening: No; Mount: Surface Mount; Package Quantity: 3000; Frequency Stability: 30ppm; Min Operating Temperature: -40°C; Packaging: Tape and Reel; Number of Pins: 4; Frequency: 25MHz; Height: 0.039inch; Tolerance: 20ppm; Length: 3.2mm; Frequency Tolerance: 20ppm; Series Resistance: 60R; Depth: 2.5mm; Case/Package: SMD/SMT; Load Capacitance: 18pF
Y2 = CMP-40224-000010-1: CRYSTAL 32.768KHZ 6PF SMD; Manufacturer: ECS Inc.; Esr: 70kΩ; Tolerance: 10ppm; Automotive Grade: Grade 3; ComponentLink2Description: Datasheet; Automotive: Yes; Temperature Range Low: -40°C; Manufacturer Part Number: ECS-.327-6-34QCN-TR; Device Class L2: Crystals / Oscillators; Temperature Range High: +85°C; Series: ECX-34Q; ComponentLink2URL: https://ecsxtal.com/store/pdf/ECX-34Q.pdf; Device Class L3: Crystals; Device Class L1: Passive Components; Octopart: https://octopart.com/ecs-.327-6-34qcn-tr-ecs+international-97157707; Load Capacitance: 6pF; Temperature: -40°C to +85°C; Category: Crys; Lead Free: Yes; Package: ECX-34Q; RoHS: TRUE; Digikey Description: CRYSTAL 32.768KHZ 6PF SMD; Height: 0.9mm